# EasyEDA Pro project ProPrj_GoWinSDR_2025-10-27.epro, board PCB1_1
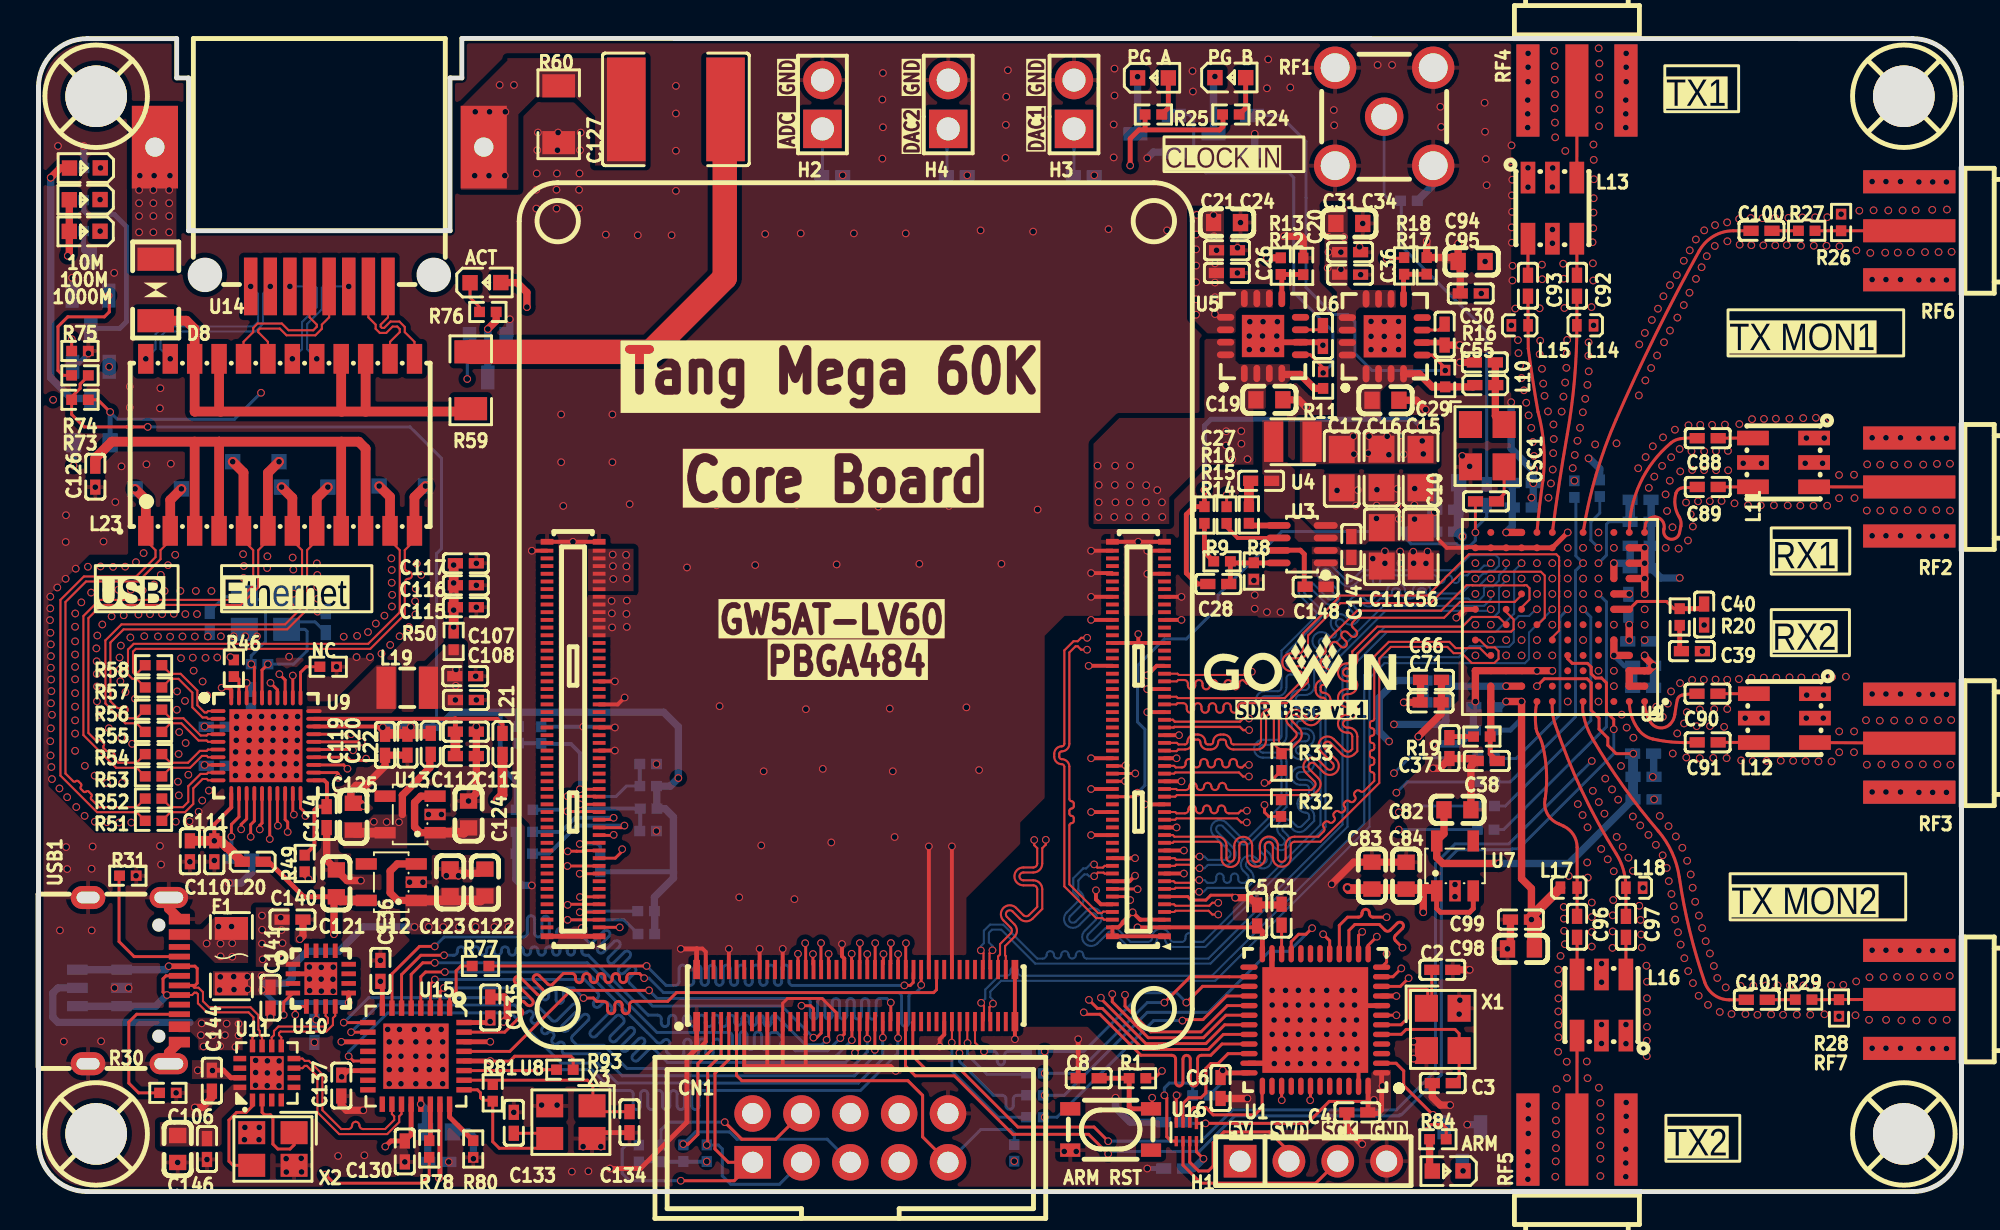
[diagram p8: board, top side]
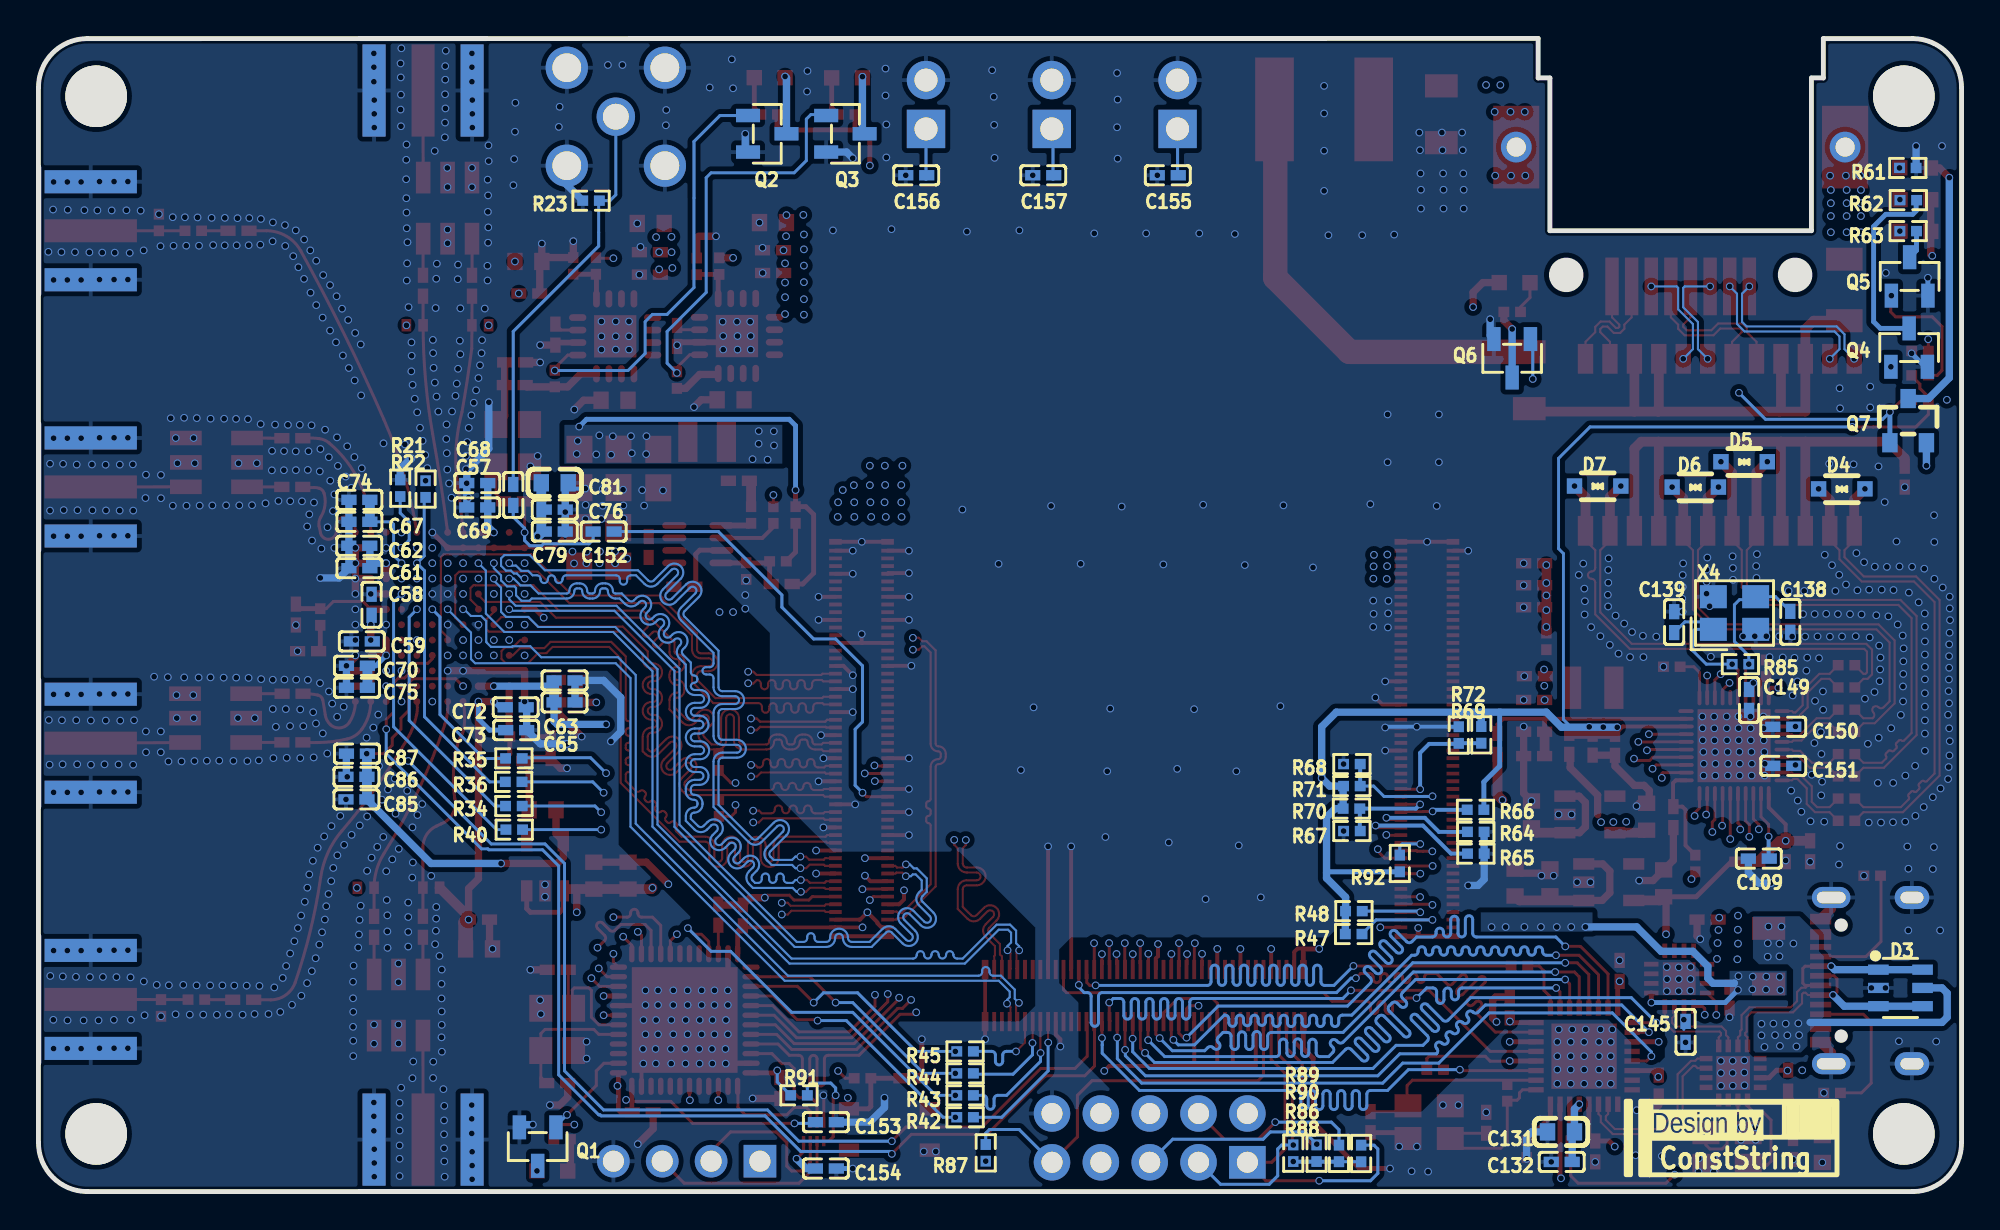
[diagram p9: board, bottom side, seen from below]

Outline 100 x 60.01 mm; copper layers: Top Layer, Inner1, Inner2, Inner3, Inner4, Bottom Layer. Coordinates in mm from the lower left corner of the outline.
Outline path: 7.81,57.95 7.19,57.95 7.19,60 2.54,60 arc(0.74,59.26) 0,57.46 0,2.54 arc(0.74,0.74) 2.54,0 97.46,0 arc(99.26,0.74) 100,2.54 100,57.46 arc(99.26,59.26) 97.46,60 22.02,60.01 22.02,57.95 21.41,57.95
Stack: Top Layer 0.035mm 外层铜厚1oz / Dielectric1 0.0994mm 3313 RC57% 4.2mil / Inner1 0.0152mm 内层铜厚 / Dielectric2 0.55mm 0.55mm H/H No copper / Inner2 0.0152mm 内层铜厚 / Dielectric3 0.1088mm 2116 RC54% 4.9mil / Inner3 0.0152mm 内层铜厚 / Dielectric4 0.55mm 0.55mm H/H No copper / Inner4 0.0152mm 内层铜厚 / Dielectric5 0.0994mm 3313 RC57% 4.2mil / Bottom Layer 0.035mm 外层铜厚1oz

## Design rules (mm)
net DN: DP26
net DP: DP26
net $7N3729: DP24
net $7N3719: DP24
net $7N3757: DP23
net $7N3751: DP23
net $7N3767: DP22
net $7N3761: DP22
net $7N3784: DP21
net $7N3774: DP21
net ETH0_MDI0_P: DP31
net ETH0_MDI0_N: DP31
net ETH0_MDI1_P: DP30
net ETH0_MDI1_N: DP30
net ETH0_MDI2_P: DP29
net ETH0_MDI2_N: DP29
net ETH0_MDI3_P: DP28
net ETH0_MDI3_N: DP28
net BANK1_B18_IOT104B: DP1
net BANK1_C17_IOT106B: DP3
net BANK2_E22_IOT140A: DP32
net BANK2_D22_IOT140B: DP32
net BANK2_E21_IOT138A: DP33
net BANK2_D21_IOT138B: DP33
net PHY0_MDI3_N: DP17
net PHY0_MDI3_P: DP17
net PHY0_MDI2_N: DP18
net PHY0_MDI2_P: DP18
net PHY0_MDI1_N: DP19
net PHY0_MDI1_P: DP19
net PHY0_MDI0_N: DP20
net PHY0_MDI0_P: DP20
net BANK1_C14_IOT85A: DP8
net BANK1_E13_IOT78A: DP4
net BANK2_A21_IOT135B: DP16
net BANK2_B22_IOT133B: DP15
net BANK2_E18_IOT117B: DP14
net BANK1_C13_IOT93A: DP7
net BANK1_C15_IOT85B: DP8
net BANK1_E14_IOT78B: DP4
net BANK2_B21_IOT135A: DP16
net BANK2_C22_IOT133A: DP15
net BANK2_F18_IOT117A: DP14
net BANK2_G22_IOT144B: DP13
net BANK1_A13_IOT95A: DP6
net BANK1_B13_IOT93B: DP7
net BANK1_D17_IOT106A: DP3
net BANK2_G21_IOT144A: DP13
net BANK2_C20_IOT131B: DP12
net BANK1_B15_IOT97A: DP5
net BANK1_A14_IOT95B: DP6
net BANK1_B17_IOT104A: DP1
net BANK2_D20_IOT131A: DP12
net BANK2_A19_IOT113B: DP10
net BANK1_A15_IOT99A: DP2
net BANK1_B16_IOT97B: DP5
net BANK2_C18_IOT115A: DP11
net BANK2_C19_IOT115B: DP11
net BANK2_A18_IOT113A: DP10
net BANK2_A20_IOT122B: DP9
net BANK1_A16_IOT99B: DP2
net BANK2_B20_IOT122A: DP9
net USART_DP: DP27
net USART_DN: DP27
net USB_DN: DP25
net USB_DP: DP25
template: 自定义配置
spacing copperThickness1oz (default): track to track 0.152, other pairs 0.102 to 0.3
spacing copperThickness2oz: track to track 0.203, other pairs 0.152 to 0.3
track width copperThickness1oz (default): min 0.127, default 0.157, max 2.54
track width copperThickness2oz: min 0.203, default 0.254, max 2.54
differential pair differentialPair (default): width min 0.102, default 0.109, max 2.54; gap min 0.152, default 0.152
via viaSize (default): diameter min 0.3, default 0.399, max 10; hole min 0.3, default 0.3, max 6.299

## Placement (name value [footprint] x y rotation side)
10M  XL-1608SURC-06  [LED0603-RD_RED]  2.41 53.27 180 top
100M  XL-1608SURC-06  [LED0603-RD_RED]  2.4 51.62 180 top
1000M  XL-1608SURC-06  [LED0603-RD_RED]  2.4 49.97 180 top
ACT  XL-1608SURC-06  [LED0603-RD_RED]  23.24 47.3 0 top
ARM  XL-1608SURC-06  [LED0603-RD_RED]  73.28 1.07 180 top
ARM RST  SKRPACE010  [KEY-SMD_4P-L4.2-W3.2-P2.20-LS4.6]  55.75 3.23 0 top
C1  100nF  [C0402]  64.64 14.41 270 top
C2  12pF  [C0402]  73 11.54 0 top
C3  12pF  [C0402]  73.03 5.64 0 top
C4  100nF  [C0402]  68.58 4.12 0 top
C5  100nF  [C0402]  63.37 14.37 270 top
C6  100nF  [C0402]  61.47 5.39 90 top
C8  100nF  [C0402]  54.61 5.9 0 top
C10  22uF  [C0805]  71.88 33.55 270 top
C11  22uF  [C0805]  69.85 33.55 270 top
C15  22uF  [C0805]  71.87 37.63 90 top
C16  22uF  [C0805]  69.84 37.63 90 top
C17  22uF  [C0805]  67.77 37.62 90 top
C19  4.7uF  [C0603]  64.01 41.2 180 top
C20  10nF  [C0402]  66.79 44.52 90 top
C21  10uF  [C0603]  61.81 50.43 180 top
C24  100nF  [C0402]  61.8 48.98 180 top
C26  100nF  [C0402]  61.8 47.8 180 top
C27  100nF  [C0402]  63.58 36.99 0 top
C28  220pF  [C0402]  61.35 31.62 180 top
C29  4.7uF  [C0603]  70.04 41.18 180 top
C30  10nF  [C0402]  73.12 44.6 90 top
C31  10uF  [C0603]  68.16 50.38 180 top
C34  100nF  [C0402]  68.21 48.89 180 top
C36  100nF  [C0402]  68.21 47.72 180 top
C37  1uF  [C0402]  73.37 23.08 90 top
C38  1nF  [C0402]  75.31 22.41 180 top
C39  1uF  [C0402]  85.98 28.12 180 top
C40  1nF  [C0402]  86.61 30.03 270 top
C55  100nF  [C0402]  75.21 43.15 180 top
C56  100nF  [C0402]  75.27 35.92 0 top
C57  100nF  [C0402]  75.31 36.25 270 bottom
C58  1uF  [C0402]  82.68 30.54 270 bottom
C59  10nF  [C0402]  83.19 28.63 180 bottom
C61  1uF  [C0402]  83.31 32.44 180 bottom
C62  1uF  [C0402]  83.32 33.61 180 bottom
C63  10nF  [C0402]  72.64 26.6 0 bottom
C65  10nF  [C0402]  72.64 25.46 0 bottom
C66  1uF  [C0402]  72.41 26.63 180 top
C67  1uF  [C0402]  83.31 34.85 180 bottom
C68  1uF  [C0402]  77.18 36.87 180 bottom
C69  1uF  [C0402]  77.18 35.6 180 bottom
C70  1uF  [C0402]  83.44 27.36 180 bottom
C71  10nF  [C0402]  72.39 25.46 180 top
C72  10nF  [C0402]  75.18 25.2 0 bottom
C73  10nF  [C0402]  75.16 24.01 0 bottom
C74  10nF  [C0402]  83.31 36 180 bottom
C75  10nF  [C0402]  83.44 26.22 180 bottom
C76  10nF  [C0402]  73.15 35.49 0 bottom
C79  1uF  [C0402]  73.15 34.35 0 bottom
C81  10uF  [C0603]  73.15 36.89 0 bottom
C82  10uF  [C0603]  73.79 19.87 0 top
C83  10uF  [C0603]  71.12 16.44 90 top
C84  100nF  [C0603]  69.34 16.44 270 top
C85  10nF  [C0402]  83.47 20.41 180 bottom
C86  1uF  [C0402]  83.46 21.58 180 bottom
C87  100nF  [C0402]  83.44 22.79 180 bottom
C88  18pF  [C0402]  86.8 39.2 180 top
C89  18pF  [C0402]  86.8 36.67 180 top
C90  18pF  [C0402]  86.79 25.91 180 top
C91  18pF  [C0402]  86.8 23.38 180 top
C92  18pF  [C0402]  80 47.14 90 top
C93  18pF  [C0402]  77.45 47.14 90 top
C94  10uF  [C0603]  74.52 48.4 0 top
C95  1nF  [C0402]  74.48 46.74 0 top
C96  18pF  [C0402]  80.01 13.78 270 top
C97  18pF  [C0402]  82.55 13.78 270 top
C98  10uF  [C0603]  77.09 12.63 0 top
C99  1nF  [C0402]  77.09 14.15 0 top
C100  1nF  [C0402]  89.6 50 180 top
C101  1nF  [C0402]  89.35 9.98 180 top
C106  10uF  [C0603]  7.24 2.22 270 top
C107  4.7uF  [C0402]  22.19 26.82 0 top
C108  100nF  [C0402]  22.22 25.58 0 top
C109  10nF  [C0402]  10.54 17.33 0 bottom
C110  100nF  [C0402]  9.14 17.71 90 top
C111  100nF  [C0402]  7.87 17.71 90 top
C112  4.7uF  [C0402]  22.22 23.93 180 top
C113  100nF  [C0402]  22.22 22.66 180 top
C114  100nF  [C0402]  14.99 19.49 90 top
C115  100nF  [C0402]  22.22 30.41 180 top
C116  100nF  [C0402]  22.22 31.55 180 top
C117  100nF  [C0402]  22.22 32.69 180 top
C119  4.7uF  [C0402]  18.02 23.25 90 top
C120  100nF  [C0402]  19.19 23.26 90 top
C121  10uF  [C0603]  15.49 16.04 90 top
C122  10uF  [C0603]  23.22 16.08 90 top
C123  100nF  [C0603]  21.41 16.09 270 top
C124  1uF  [C0603]  22.36 19.62 270 top
C125  1uF  [C0603]  16.38 19.51 270 top
C126  10nF  [C0402]  2.96 37.2 90 top
C127  1nF  [C2220]  33.15 56.32 0 top
C130  2.2uF  [C0402]  19.05 2.09 270 top
C131  100nF  [C0402]  20.79 1.54 180 bottom
C132  10uF  [C0603]  20.83 3.1 180 bottom
C133  12pF  [C0402]  24.72 3.58 90 top
C134  12pF  [C0402]  30.73 3.61 270 top
C135  100nF  [C0402]  23.5 9.58 270 top
C136  100nF  [C0402]  17.78 11.49 270 top
C137  100nF  [C0402]  15.75 5.52 90 top
C138  12pF  [C0402]  8.91 29.65 90 bottom
C139  12pF  [C0402]  14.94 29.64 90 bottom
C140  1uF  [C0402]  13.21 14.15 0 top
C141  1uF  [C0402]  12.06 10.09 270 top
C144  1uF  [C0402]  9.02 5.77 270 top
C145  100nF  [C0402]  14.35 8.31 90 bottom
C146  100nF  [C0402]  8.76 2.22 270 top
C147  1uF  [C0402]  68.27 33.54 270 top
C148  1uF  [C0402]  66.41 31.48 180 top
C149  100nF  [C0402]  11.05 25.58 90 bottom
C150  100nF  [C0402]  9.27 24.19 180 bottom
C151  100nF  [C0402]  9.27 22.15 180 bottom
C152  100nF  [C0402]  70.61 34.35 0 bottom
C153  100nF  [C0402]  59.06 3.61 0 bottom
C154  100nF  [C0402]  59.06 1.2 180 bottom
C155  100nF  [C0402]  41.28 52.89 0 bottom
C156  100nF  [C0402]  54.36 52.89 0 bottom
C157  100nF  [C0402]  47.75 52.89 0 bottom
CN1  DC3-2.54-10PAS  [CONN-TH_10P-P2.54_DC3-2.54-10PAS]  42.22 2.79 0 top
D3  BST236A054U-ES  [SOT-23-6_L2.9-W1.6-P0.95-LS2.8-TL]  3.17 10.6 180 bottom
D4  UDD32C03L01  [SOD-323_L1.7-W1.3-LS2.5-BI]  6.23 36.57 0 bottom
D5  UDD32C03L01  [SOD-323_L1.7-W1.3-LS2.5-BI]  11.31 37.98 0 bottom
D6  UDD32C03L01  [SOD-323_L1.7-W1.3-LS2.5-BI]  13.85 36.66 0 bottom
D7  UDD32C03L01  [SOD-323_L1.7-W1.3-LS2.5-BI]  18.92 36.72 0 bottom
D8  SMB90XM  [DIO-DT-SMD_L3.2-W1.6]  6.1 46.92 90 top
F1  SMD1206-100-30  [F1206]  10.03 12.25 270 top
H1  PZ254V-11-04P  [HDR-TH_4P-P2.54-V-M]  66.29 1.58 0 top
H2  PZ254V-11-02P  [HDR-TH_2P-P2.54-V-M]  40.77 56.57 90 top
H3  PZ254V-11-02P  [HDR-TH_2P-P2.54-V-M]  53.85 56.57 90 top
H4  PZ254V-11-02P  [HDR-TH_2P-P2.54-V-M]  47.31 56.57 90 top
L10  BLM15PD121SN1D  [L0402]  75.23 41.97 180 top
L11  TCM1-63AX+  [XFMR-SMD_TCM1-63AX]  90.74 37.94 270 top
L12  TCM1-63AX+  [XFMR-SMD_TCM1-63AX]  90.79 24.64 270 top
L13  TCM1-63AX+  [XFMR-SMD_TCM1-63AX]  78.73 51.18 0 top
L14  330nH  [IND-SMD_L1.0-W0.6]  80.43 45.08 180 top
L15  330nH  [IND-SMD_L1.0-W0.6]  77.03 45.08 0 top
L16  TCM1-63AX+  [XFMR-SMD_TCM1-63AX]  81.28 9.71 180 top
L17  330nH  [IND-SMD_L1.0-W0.6]  79.58 15.82 0 top
L18  330nH  [IND-SMD_L1.0-W0.6]  82.98 15.81 180 top
L19  2.2uH  [IND-SMD_L2.5-W2.0_MHCHL2520]  19.18 26.22 0 top
L20  BLM15PD121SN1D  [L0402]  11.14 17.16 180 top
L21  BLM15PD121SN1D  [L0402]  24.13 23.3 90 top
L22  BLM15PD121SN1D  [L0402]  20.4 23.3 90 top
L23  350uH  [XFMR-SMD_24P-L15.6-W8.5-P1.27-LS9.5-BL]  12.57 38.86 0 top
NC  5.1kΩ  [R0402]  15.07 27.31 0 top
OSC1  40MHz  [OSC-SMD_4P-L3.2-W2.5-BL]  75.34 38.81 270 top
PG A  NCD0603Y2  [LED0603-RD]  57.95 57.95 0 top
PG B  NCD0603Y2  [LED0603-RD]  61.98 57.97 0 top
Q1  AO3400A  [SOT-23-3_L2.9-W1.3-P1.90-LS2.4-BR]  74.04 2.34 90 bottom
Q2  AO3400A  [SOT-23-3_L2.9-W1.3-P1.90-LS2.4-BR]  62.1 55.05 0 bottom
Q3  AO3400A  [SOT-23-3_L2.9-W1.3-P1.90-LS2.4-BR]  58.04 55.05 0 bottom
Q4  AO3400A  [SOT-23-3_L2.9-W1.3-P1.90-LS2.4-BR]  2.72 43.92 270 bottom
Q5  AO3400A  [SOT-23-3_L2.9-W1.3-P1.90-LS2.4-BR]  2.7 47.62 270 bottom
Q6  AO3400A  [SOT-23-3_L2.9-W1.3-P1.90-LS2.4-BR]  23.37 43.36 90 bottom
Q7  AO3401A  [SOT-23_L2.9-W1.3-P1.90-LS2.4-BR]  2.78 40.12 270 bottom
R1  10kΩ  [R0402]  57.15 5.9 180 top
R8  43kΩ  [R0402]  63.2 32.29 90 top
R9  86.6kΩ  [R0402]  61.55 32.8 180 top
R10  0Ω  [R0402]  60.63 35.21 90 top
R11  10kΩ  [R0402]  66.8 42.23 270 top
R12  16kΩ  [R0402]  64.6 48.16 90 top
R13  10kΩ  [R0402]  65.77 48.15 270 top
R14  10Ω  [R0402]  62.94 35.21 270 top
R15  10kΩ  [R0402]  61.78 35.21 270 top
R16  10kΩ  [R0402]  73.15 42.31 270 top
R17  16kΩ  [R0402]  71.01 48.17 90 top
R18  10kΩ  [R0402]  72.19 48.17 270 top
R19  1Ω  [R0402]  75.06 23.68 0 top
R20  1Ω  [R0402]  85.34 29.9 90 top
R21  10kΩ  [R0402]  79.87 36.56 90 bottom
R22  14.3kΩ  [R0402]  81.19 36.6 90 bottom
R23  49.9Ω  [R0402]  71.27 51.56 180 bottom
R24  10kΩ  [R0402]  62.01 56.05 180 top
R25  10kΩ  [R0402]  57.98 56.05 180 top
R26  49.9Ω  [R0402]  93.74 50.43 270 top
R27  10Ω  [R0402]  91.95 50 180 top
R28  49.9Ω  [R0402]  93.63 9.55 90 top
R29  10Ω  [R0402]  91.79 9.99 180 top
R30  5.1kΩ  [R0402]  6.73 5.14 0 top
R31  5.1kΩ  [R0402]  4.65 16.44 0 top
R32  NC  [R0402]  64.61 19.96 270 top
R33  NC  [R0402]  64.64 22.35 270 top
R34  0Ω  [R0402]  75.28 20.06 0 bottom
R35  0Ω  [R0402]  75.28 22.54 0 bottom
R36  0Ω  [R0402]  75.29 21.32 0 bottom
R40  0Ω  [R0402]  75.26 18.83 0 bottom
R42  0Ω  [R0402]  51.82 3.87 0 bottom
R43  0Ω  [R0402]  51.82 5.01 0 bottom
R44  0Ω  [R0402]  51.82 6.15 0 bottom
R45  0Ω  [R0402]  51.82 7.29 0 bottom
R46  2.49kΩ  [R0402]  10.16 27.23 90 top
R47  1.5kΩ  [R0402]  31.61 13.4 0 bottom
R48  1.5kΩ  [R0402]  31.6 14.59 0 bottom
R49  0Ω  [R0402]  13.84 17.07 90 top
R50  0Ω  [R0402]  21.59 28.63 90 top
R51  2.2Ω  [R0402]  5.98 19.3 180 top
R52  2.2Ω  [R0402]  5.98 20.45 180 top
R53  2.2Ω  [R0402]  5.98 21.61 180 top
R54  2.2Ω  [R0402]  5.98 22.76 180 top
R55  2.2Ω  [R0402]  5.98 23.92 180 top
R56  2.2Ω  [R0402]  5.98 25.08 180 top
R57  2.2Ω  [R0402]  5.98 26.23 180 top
R58  2.2Ω  [R0402]  5.98 27.39 180 top
R59  75Ω  [R1206]  22.48 42.22 270 top
R60  0Ω  [R1206]  27.05 56.06 90 top
R61  10kΩ  [R0402]  2.79 53.27 180 bottom
R62  10kΩ  [R0402]  2.77 51.59 180 bottom
R63  10kΩ  [R0402]  2.77 49.98 180 bottom
R64  5.1kΩ  [R0402]  25.26 18.72 180 bottom
R65  5.1kΩ  [R0402]  25.26 17.59 180 bottom
R66  5.1kΩ  [R0402]  25.27 19.87 0 bottom
R67  5.1kΩ  [R0402]  31.7 18.76 0 bottom
R68  5.1kΩ  [R0402]  31.7 22.25 0 bottom
R69  5.1kΩ  [R0402]  26.14 23.76 90 bottom
R70  5.1kΩ  [R0402]  31.72 19.93 180 bottom
R71  5.1kΩ  [R0402]  31.7 21.1 180 bottom
R72  5.1kΩ  [R0402]  24.97 23.77 270 bottom
R73  5.1kΩ  [R0402]  2.16 41.2 0 top
R74  5.1kΩ  [R0402]  2.16 42.47 180 top
R75  5.1kΩ  [R0402]  2.16 43.74 0 top
R76  10kΩ  [R0402]  23.37 45.78 0 top
R77  33Ω  [R0402]  22.99 11.74 180 top
R78  1kΩ  [R0402]  20.32 2.22 270 top
R80  8.06kΩ  [R0402]  22.61 2.22 270 top
R81  10MΩ  [R0402]  23.62 5.14 270 top
R84  10kΩ  [R0402]  72.77 2.72 0 top
R85  10MΩ  [R0402]  11.5 27.45 180 bottom
R86  10kΩ  [R0402]  32.37 1.99 270 bottom
R87  10kΩ  [R0402]  50.74 2.02 270 bottom
R88  10kΩ  [R0402]  31.22 1.98 270 bottom
R89  10kΩ  [R0402]  34.75 2 270 bottom
R90  10kΩ  [R0402]  33.54 2 270 bottom
R91  10kΩ  [R0402]  60.45 5.01 180 bottom
R92  5.1kΩ  [R0402]  29.21 17.07 90 bottom
R93  5.1kΩ  [R0402]  27.37 6.34 180 top
RF1  -  [SMA-TH_BWSMA-KE-Z001]  69.98 55.94 0 top
RF2  -  [SMA-SMD_BWSMA-KE-P001]  97.28 36.67 0 top
RF3  -  [SMA-SMD_BWSMA-KE-P001]  97.28 23.33 0 top
RF4  -  [SMA-SMD_BWSMA-KE-P001]  80 57.3 90 top
RF5  -  [SMA-SMD_BWSMA-KE-P001]  80 2.71 270 top
RF6  -  [SMA-SMD_BWSMA-KE-P001]  97.28 50 0 top
RF7  -  [SMA-SMD_BWSMA-KE-P001]  97.28 10 0 top
SCREW1  -  [M3螺丝]  3 57 0 top
SCREW2  -  [M3螺丝]  97 57 0 top
SCREW3  -  [M3螺丝]  97 3 0 top
SCREW4  -  [M3螺丝]  3 3 0 top
U1  STM32F411CEU6  [UFQFPN-48_L7.0-W7.0-P0.50-BL-EP]  66.39 8.93 90 top
U2  AD9363ABCZ  [CSPBGA-144_L10.0-W10.0-R12-C12-P0.80-TL]  79.12 29.9 180 top
U3  MP2236GJ-Z  [SOT-23-8_L2.9-W1.6-P0.65-LS2.8-BR]  65.71 33.69 0 top
U4  1.5uH  [IND-SMD_L2.5-W2.0_MEKK2520TR47M]  65.23 39.02 180 top
U5  ADP1755ACPZ-R7  [LFCSP-16_L4.0-W4.0-P0.65-BL-EP2.2]  63.68 44.52 0 top
U6  ADP1755ACPZ-R7  [LFCSP-16_L4.0-W4.0-P0.65-BL-EP2.2]  70.01 44.51 0 top
U7  ME6217C33M5G  [SOT-23-5_L3.0-W1.7-P0.95-LS2.8-BR]  73.66 16.95 270 top
U8  -  [Tang Mega 60K]  25 7.5 90 top
U9  RTL8211F-CG  [WQFN-40_L5.0-W5.0-P0.4-BL-EP]  11.83 23.2 270 top
U10  CH343P  [TQFN-16_L3.0-W3.0-P0.50-BL-EP1.7]  14.68 11.08 270 top
U11  CH334P  [QFN-16_L3.0-W3.0-P0.50-BL-EP1.7]  11.88 6.17 0 top
U12  ME6217C33M5G  [SOT-23-5_L3.0-W1.7-P0.95-LS2.8-BR]  18.34 16.1 0 top
U13  ME6211C18M5G-N  [SOT-23-5_L3.0-W1.7-P0.95-LS2.8-BR]  19.33 19.63 0 top
U14  HC-WK88-H865T-QB  [RJ45-TH_HC-WK88-H865T-BB]  14.61 50.73 180 top
U15  USB3320C-EZK  [QFN-32_L5.0-W5.0-P0.50-BL-EP3.4]  19.63 7.05 180 top
U16  TXS0102DQER  [X2SON-8_L1.4-W1.0-P0.35-BL]  59.69 3.1 180 top
USB1  TYPE-C 16PIN 2MD(073)  [USB-C-SMD_TYPE-C-6PIN-2MD-073]  4.95 10.98 270 top
X1  25MHz  [CRYSTAL-SMD_4P-L3.2-W2.5-BL]  73.03 8.44 270 top
X2  12MHz  [CRYSTAL-SMD_4P-L3.2-W2.5-BL]  12.19 2.22 180 top
X3  24MHz  [CRYSTAL-SMD_4P-L3.2-W2.5-BL]  27.69 3.61 180 top
X4  25MHz  [CRYSTAL-SMD_4P-L3.2-W2.5-BL]  11.81 30.11 180 bottom

## Footprints (pads in the part's own frame, mm; a bottom-side part is the same pattern mirrored in y, then rotated)
C0402
  rect 0.79x0.54 smd: 1(-0.545,0) 2(0.545,0)
C0603
  rect 0.8x0.9 smd: 1(-0.7,0) 2(0.7,0)
C0805
  rect 1.41x1.35 smd: 1(-1,0) 2(1,0)
C2220
  rect 2.01x5.4 smd: 1(-2.58,0) 2(2.58,0)
CONN-TH_10P-P2.54_DC3-2.54-10PAS
  rect 1.9x1.7 hole 1.1: 1(-5.08,-1.27)
  round 1.9 hole 1.1: 2(-5.08,1.27) 3(-2.54,-1.27) 4(-2.54,1.27) 5(0,-1.27) 6(0,1.27) 7(2.54,-1.27) 8(2.54,1.27) 9(5.08,-1.27) 10(5.08,1.27)
CRYSTAL-SMD_4P-L3.2-W2.5-BL
  rect 1.4x1.2 smd: 1(-1.1,-0.85) 2(1.1,-0.85) 3(1.1,0.85) 4(-1.1,0.85)
CSPBGA-144_L10.0-W10.0-R12-C12-P0.80-TL
  round 0.36 smd: A1(-4.4,4.4) A2(-3.6,4.4) A3(-2.8,4.4) A4(-2,4.4) A5(-1.2,4.4) A6(-0.4,4.4) A7(0.4,4.4) A8(1.2,4.4) A9(2,4.4) A10(2.8,4.4) A11(3.6,4.4) A12(4.4,4.4) B1(-4.4,3.6) B2(-3.6,3.6) B3(-2.8,3.6) B4(-2,3.6) B5(-1.2,3.6) B6(-0.4,3.6) B7(0.4,3.6) B8(1.2,3.6) B9(2,3.6) B10(2.8,3.6) B11(3.6,3.6) B12(4.4,3.6) C1(-4.4,2.8) C2(-3.6,2.8) C3(-2.8,2.8) C4(-2,2.8) C5(-1.2,2.8) C6(-0.4,2.8) C7(0.4,2.8) C8(1.2,2.8) C9(2,2.8) C10(2.8,2.8) C11(3.6,2.8) C12(4.4,2.8) D1(-4.4,2) D2(-3.6,2) D3(-2.8,2) D4(-2,2) D5(-1.2,2) D6(-0.4,2) D7(0.4,2) D8(1.2,2) D9(2,2) D10(2.8,2) D11(3.6,2) D12(4.4,2) E1(-4.4,1.2) E2(-3.6,1.2) E3(-2.8,1.2) E4(-2,1.2) E5(-1.2,1.2) E6(-0.4,1.2) E7(0.4,1.2) E8(1.2,1.2) E9(2,1.2) E10(2.8,1.2) E11(3.6,1.2) E12(4.4,1.2) F1(-4.4,0.4) F2(-3.6,0.4) F3(-2.8,0.4) F4(-2,0.4) F5(-1.2,0.4) F6(-0.4,0.4) F7(0.4,0.4) F8(1.2,0.4) F9(2,0.4) F10(2.8,0.4) F11(3.6,0.4) F12(4.4,0.4) G1(-4.4,-0.4) G2(-3.6,-0.4) G3(-2.8,-0.4) G4(-2,-0.4) G5(-1.2,-0.4) G6(-0.4,-0.4) G7(0.4,-0.4) G8(1.2,-0.4) G9(2,-0.4) G10(2.8,-0.4) G11(3.6,-0.4) G12(4.4,-0.4) H1(-4.4,-1.2) H2(-3.6,-1.2) H3(-2.8,-1.2) H4(-2,-1.2) H5(-1.2,-1.2) H6(-0.4,-1.2) H7(0.4,-1.2) H8(1.2,-1.2) H9(2,-1.2) H10(2.8,-1.2) H11(3.6,-1.2) H12(4.4,-1.2) J1(-4.4,-2) J2(-3.6,-2) J3(-2.8,-2) J4(-2,-2) J5(-1.2,-2) J6(-0.4,-2) J7(0.4,-2) J8(1.2,-2) J9(2,-2) J10(2.8,-2) J11(3.6,-2) J12(4.4,-2) K1(-4.4,-2.8) K2(-3.6,-2.8) K3(-2.8,-2.8) K4(-2,-2.8) K5(-1.2,-2.8) K6(-0.4,-2.8) K7(0.4,-2.8) K8(1.2,-2.8) K9(2,-2.8) K10(2.8,-2.8) K11(3.6,-2.8) K12(4.4,-2.8) L1(-4.4,-3.6) L2(-3.6,-3.6) L3(-2.8,-3.6) L4(-2,-3.6) L5(-1.2,-3.6) L6(-0.4,-3.6) L7(0.4,-3.6) L8(1.2,-3.6) L9(2,-3.6) L10(2.8,-3.6) L11(3.6,-3.6) L12(4.4,-3.6) M1(-4.4,-4.4) M2(-3.6,-4.4) M3(-2.8,-4.4) M4(-2,-4.4) M5(-1.2,-4.4) M6(-0.4,-4.4) M7(0.4,-4.4) M8(1.2,-4.4) M9(2,-4.4) M10(2.8,-4.4) M11(3.6,-4.4) M12(4.4,-4.4)
DIO-DT-SMD_L3.2-W1.6
  rect 1.2x1.9 smd: 1(-1.6,0) 2(1.6,0)
F1206
  rect 1.19x1.728 smd: 1(-1.445,0) 2(1.445,0)
HDR-TH_2P-P2.54-V-M
  rect 2x2 hole 1.2: 1(-1.27,0)
  round 2 hole 1.2: 2(1.27,0)
HDR-TH_4P-P2.54-V-M
  rect 1.7x1.7 hole 1.1: 1(-3.81,0)
  round 1.7 hole 1.1: 2(-1.27,0) 3(1.27,0) 4(3.81,0)
IND-SMD_L1.0-W0.6
  rect 0.5x0.648 smd: 1(-0.434,0) 2(0.434,0)
IND-SMD_L2.5-W2.0_MEKK2520TR47M
  rect 1x2.1 smd: 1(1,0) 2(-1,0)
IND-SMD_L2.5-W2.0_MHCHL2520
  rect 1x2.2 smd: 1(-1.1,0) 2(1.1,0)
KEY-SMD_4P-L4.2-W3.2-P2.20-LS4.6
  rect 1.05x0.7 smd: 1(-2.1,1.075) 2(2.1,1.075) 3(-2.1,-1.075) 4(2.1,-1.075)
L0402
  rect 0.79x0.54 smd: 1(-0.545,0) 2(0.545,0)
LED0603-RD
  rect 0.8x0.8 smd: 1(-0.799,0) 2(0.799,0)
LED0603-RD_RED
  rect 0.8x0.8 smd: 1(-0.799,-0.004) 2(0.799,0.004)
LFCSP-16_L4.0-W4.0-P0.65-BL-EP2.2
  oval 0.35x0.9 smd: 1(-0.975,-1.95) 2(-0.325,-1.95) 3(0.325,-1.95) 4(0.975,-1.95) 9(0.975,1.95) 10(0.325,1.95) 11(-0.325,1.95) 12(-0.975,1.95)
  oval 0.9x0.35 smd: 5(1.95,-0.975) 6(1.95,-0.325) 7(1.95,0.325) 8(1.95,0.975) 13(-1.95,0.975) 14(-1.95,0.325) 15(-1.95,-0.325) 16(-1.95,-0.975)
  rect 2.2x2.2 smd: 17(0,0)
M3螺丝
  round 3.2 hole 3.2: 1(0,0)
OSC-SMD_4P-L3.2-W2.5-BL
  rect 1.4x1.2 smd: 1(-1.1,-0.875) 2(1.1,-0.875) 3(1.1,0.875) 4(-1.1,0.875)
QFN-16_L3.0-W3.0-P0.50-BL-EP1.7
  rect 0.28x0.665 smd: 1(-0.75,-1.407) 2(-0.25,-1.407) 3(0.25,-1.407) 4(0.75,-1.407) 9(0.75,1.407) 10(0.25,1.407) 11(-0.25,1.407) 12(-0.75,1.407)
  rect 0.665x0.28 smd: 5(1.407,-0.75) 6(1.407,-0.25) 7(1.407,0.25) 8(1.407,0.75) 13(-1.407,0.75) 14(-1.407,0.25) 15(-1.407,-0.25) 16(-1.407,-0.75)
  rect 1.75x1.75 smd: 17(0,0)
QFN-32_L5.0-W5.0-P0.50-BL-EP3.4
  rect 0.28x0.8 smd: 1(-1.75,-2.5) 2(-1.252,-2.5) 3(-0.751,-2.5) 4(-0.252,-2.5) 5(0.248,-2.5) 6(0.749,-2.5) 7(1.248,-2.5) 8(1.748,-2.5) 17(1.752,2.5) 18(1.252,2.5) 19(0.751,2.5) 20(0.252,2.5) 21(-0.248,2.5) 22(-0.749,2.5) 23(-1.248,2.5) 24(-1.748,2.5)
  rect 0.8x0.28 smd: 9(2.5,-1.748) 10(2.5,-1.248) 11(2.5,-0.748) 12(2.5,-0.248) 13(2.5,0.252) 14(2.5,0.752) 15(2.5,1.252) 16(2.5,1.752) 25(-2.5,1.75) 26(-2.5,1.25) 27(-2.5,0.75) 28(-2.5,0.25) 29(-2.5,-0.25) 30(-2.5,-0.75) 31(-2.5,-1.25) 32(-2.5,-1.75)
  rect 3.4x3.4 smd: 33(0,0)
R0402
  rect 0.566x0.54 smd: 1(-0.433,0) 2(0.433,0)
R1206
  rect 1.208x1.701 smd: 1(-1.479,0) 2(1.479,0)
RJ45-TH_HC-WK88-H865T-BB
  rect 0.7x3 smd: 1(-3.57,3.625) 2(-2.55,3.625) 3(-1.53,3.625) 4(-0.51,3.625) 5(0.51,3.625) 6(1.53,3.625) 7(2.55,3.625) 8(3.57,3.625)
  round 1.6 hole 1: 9(-8.55,-3.625) 10(8.55,-3.625)
  rect 2.4x4.3 smd: 9(-8.55,-3.625) 10(8.55,-3.625)
SMA-SMD_BWSMA-KE-P001
  rect 4.8x1.2 smd: 1(0,-2.55) 2(0,2.55) 5(0,0)
  rect 4.8x1.2 smd far side: 3(0,2.55) 4(0,-2.55)
SMA-TH_BWSMA-KE-Z001
  round 2.2 hole 1.5: 1(-2.55,-2.55) 2(-2.55,2.55) 3(2.55,2.55) 4(2.55,-2.55)
  round 2 hole 1.35: 5(0,0)
SOD-323_L1.7-W1.3-LS2.5-BI
  rect 0.8x0.8 smd: 1(-1.205,0) 2(1.205,0)
SOT-23-3_L2.9-W1.3-P1.90-LS2.4-BR
  rect 1.25x0.7 smd: 1(1,-0.95) 2(1,0.95) 3(-1,0)
SOT-23-5_L3.0-W1.7-P0.95-LS2.8-BR
  rect 1.1x0.6 smd: 1(1.3,-0.95) 2(1.3,0) 3(1.3,0.95) 4(-1.3,0.95) 5(-1.3,-0.95)
SOT-23-6_L2.9-W1.6-P0.95-LS2.8-TL
  rect 1.072x0.532 smd: 1(-1.149,0.95) 2(-1.149,0) 3(-1.149,-0.95) 4(1.149,-0.95) 5(1.149,0) 6(1.149,0.95)
SOT-23-8_L2.9-W1.6-P0.65-LS2.8-BR
  oval 1.252x0.35 smd: 1(1.226,-0.975) 2(1.226,-0.325) 3(1.226,0.325) 4(1.226,0.975) 5(-1.226,0.975) 6(-1.226,0.325) 7(-1.226,-0.325) 8(-1.226,-0.975)
SOT-23_L2.9-W1.3-P1.90-LS2.4-BR
  rect 1x0.8 smd: 1(1.15,-0.95) 2(1.15,0.95) 3(-1.15,0)
Tang Mega 60K
  rect 0.2x0.66 smd: A1(6.25,-33.555) A2(6.25,-30.845) A3(6.65,-33.555) A4(6.65,-30.845) A5(7.05,-33.555) A6(7.05,-30.845) A7(7.45,-33.555) A8(7.45,-30.845) A9(7.85,-33.555) A10(7.85,-30.845) A11(8.25,-33.555) A12(8.25,-30.845) A13(8.65,-33.555) A14(8.65,-30.845) A15(9.05,-33.555) A16(9.05,-30.845) A17(9.45,-33.555) A18(9.45,-30.845) A19(9.85,-33.555) A20(9.85,-30.845) A21(10.25,-33.555) A22(10.25,-30.845) A23(10.65,-33.555) A24(10.65,-30.845) A25(11.05,-33.555) A26(11.05,-30.845) A27(11.45,-33.555) A28(11.45,-30.845) A29(11.85,-33.555) A30(11.85,-30.845) A31(12.25,-33.555) A32(12.25,-30.845) A33(12.65,-33.555) A34(12.65,-30.845) A35(13.05,-33.555) A36(13.05,-30.845) A37(13.45,-33.555) A38(13.45,-30.845) A39(13.85,-33.555) A40(13.85,-30.845) A41(14.25,-33.555) A42(14.25,-30.845) A43(14.65,-33.555) A44(14.65,-30.845) A45(15.05,-33.555) A46(15.05,-30.845) A47(15.45,-33.555) A48(15.45,-30.845) A49(15.85,-33.555) A50(15.85,-30.845) A51(16.25,-33.555) A52(16.25,-30.845) A53(16.65,-33.555) A54(16.65,-30.845) A55(17.05,-33.555) A56(17.05,-30.845) A57(17.45,-33.555) A58(17.45,-30.845) A59(17.85,-33.555) A60(17.85,-30.845) A61(18.25,-33.555) A62(18.25,-30.845) A63(18.65,-33.555) A64(18.65,-30.845) A65(19.05,-33.555) A66(19.05,-30.845) A67(19.45,-33.555) A68(19.45,-30.845) A69(19.85,-33.555) A70(19.85,-30.845) A71(20.25,-33.555) A72(20.25,-30.845) A73(20.65,-33.555) A74(20.65,-30.845) A75(21.05,-33.555) A76(21.05,-30.845) A77(21.45,-33.555) A78(21.45,-30.845) A79(21.85,-33.555) A80(21.85,-30.845) A81(22.25,-33.555) A82(22.25,-30.845) A83(22.65,-33.555) A84(22.65,-30.845) A85(23.05,-33.555) A86(23.05,-30.845) A87(23.45,-33.555) A88(23.45,-30.845) A89(23.85,-33.555) A90(23.85,-30.845) A91(24.25,-33.555) A92(24.25,-30.845) A93(24.65,-33.555) A94(24.65,-30.845) A95(25.05,-33.555) A96(25.05,-30.845) A97(25.45,-33.555) A98(25.45,-30.845) A99(25.85,-33.555) A100(25.85,-30.845) B1(6.25,-4.155) B2(6.25,-1.445) B3(6.65,-4.155) B4(6.65,-1.445) B5(7.05,-4.155) B6(7.05,-1.445) B7(7.45,-4.155) B8(7.45,-1.445) B9(7.85,-4.155) B10(7.85,-1.445) B11(8.25,-4.155) B12(8.25,-1.445) B13(8.65,-4.155) B14(8.65,-1.445) B15(9.05,-4.155) B16(9.05,-1.445) B17(9.45,-4.155) B18(9.45,-1.445) B19(9.85,-4.155) B20(9.85,-1.445) B21(10.25,-4.155) B22(10.25,-1.445) B23(10.65,-4.155) B24(10.65,-1.445) B25(11.05,-4.155) B26(11.05,-1.445) B27(11.45,-4.155) B28(11.45,-1.445) B29(11.85,-4.155) B30(11.85,-1.445) B31(12.25,-4.155) B32(12.25,-1.445) B33(12.65,-4.155) B34(12.65,-1.445) B35(13.05,-4.155) B36(13.05,-1.445) B37(13.45,-4.155) B38(13.45,-1.445) B39(13.85,-4.155) B40(13.85,-1.445) B41(14.25,-4.155) B42(14.25,-1.445) B43(14.65,-4.155) B44(14.65,-1.445) B45(15.05,-4.155) B46(15.05,-1.445) B47(15.45,-4.155) B48(15.45,-1.445) B49(15.85,-4.155) B50(15.85,-1.445) B51(16.25,-4.155) B52(16.25,-1.445) B53(16.65,-4.155) B54(16.65,-1.445) B55(17.05,-4.155) B56(17.05,-1.445) B57(17.45,-4.155) B58(17.45,-1.445) B59(17.85,-4.155) B60(17.85,-1.445) B61(18.25,-4.155) B62(18.25,-1.445) B63(18.65,-4.155) B64(18.65,-1.445) B65(19.05,-4.155) B66(19.05,-1.445) B67(19.45,-4.155) B68(19.45,-1.445) B69(19.85,-4.155) B70(19.85,-1.445) B71(20.25,-4.155) B72(20.25,-1.445) B73(20.65,-4.155) B74(20.65,-1.445) B75(21.05,-4.155) B76(21.05,-1.445) B77(21.45,-4.155) B78(21.45,-1.445) B79(21.85,-4.155) B80(21.85,-1.445) B81(22.25,-4.155) B82(22.25,-1.445) B83(22.65,-4.155) B84(22.65,-1.445) B85(23.05,-4.155) B86(23.05,-1.445) B87(23.45,-4.155) B88(23.45,-1.445) B89(23.85,-4.155) B90(23.85,-1.445) B91(24.25,-4.155) B92(24.25,-1.445) B93(24.65,-4.155) B94(24.65,-1.445) B95(25.05,-4.155) B96(25.05,-1.445) B97(25.45,-4.155) B98(25.45,-1.445) B99(25.85,-4.155) B100(25.85,-1.445)
  rect 0.3x0.66 smd: AS1(5.785,-33.555) AS2(5.785,-30.845) AS3(26.315,-33.555) AS4(26.315,-30.845) BS1(5.785,-4.155) BS2(5.785,-1.445) BS3(26.315,-4.155) BS4(26.315,-1.445)
  rect 1x0.2 smd: C1(1.345,-9.7) C2(4.055,-9.7) C3(1.345,-10.1) C4(4.055,-10.1) C5(1.345,-10.5) C6(4.055,-10.5) C7(1.345,-10.9) C8(4.055,-10.9) C9(1.345,-11.3) C10(4.055,-11.3) C11(1.345,-11.7) C12(4.055,-11.7) C13(1.345,-12.1) C14(4.055,-12.1) C15(1.345,-12.5) C16(4.055,-12.5) C17(1.345,-12.9) C18(4.055,-12.9) C19(1.345,-13.3) C20(4.055,-13.3) C21(1.345,-13.7) C22(4.055,-13.7) C23(1.345,-14.1) C24(4.055,-14.1) C25(1.345,-14.5) C26(4.055,-14.5) C27(1.345,-14.9) C28(4.055,-14.9) C29(1.345,-15.3) C30(4.055,-15.3) C31(1.345,-15.7) C32(4.055,-15.7) C33(1.345,-16.1) C34(4.055,-16.1) C35(1.345,-16.5) C36(4.055,-16.5) C37(1.345,-16.9) C38(4.055,-16.9) C39(1.345,-17.3) C40(4.055,-17.3) C41(1.345,-17.7) C42(4.055,-17.7) C43(1.345,-18.1) C44(4.055,-18.1) C45(1.345,-18.5) C46(4.055,-18.5) C47(1.345,-18.9) C48(4.055,-18.9) C49(1.345,-19.3) C50(4.055,-19.3) C51(1.345,-19.7) C52(4.055,-19.7) C53(1.345,-20.1) C54(4.055,-20.1) C55(1.345,-20.5) C56(4.055,-20.5) C57(1.345,-20.9) C58(4.055,-20.9) C59(1.345,-21.3) C60(4.055,-21.3) C61(1.345,-21.7) C62(4.055,-21.7) C63(1.345,-22.1) C64(4.055,-22.1) C65(1.345,-22.5) C66(4.055,-22.5) C67(1.345,-22.9) C68(4.055,-22.9) C69(1.345,-23.3) C70(4.055,-23.3) C71(1.345,-23.7) C72(4.055,-23.7) C73(1.345,-24.1) C74(4.055,-24.1) C75(1.345,-24.5) C76(4.055,-24.5) C77(1.345,-24.9) C78(4.055,-24.9) C79(1.345,-25.3) C80(4.055,-25.3)
  rect 1x0.35 smd: CS1(1.345,-9.225) CS2(4.055,-9.225) CS3(1.345,-25.775) CS4(4.055,-25.775)
TQFN-16_L3.0-W3.0-P0.50-BL-EP1.7
  rect 0.25x0.75 smd: 1(-0.749,-1.45) 2(-0.248,-1.45) 3(0.252,-1.45) 4(0.751,-1.45) 9(0.75,1.45) 10(0.25,1.45) 11(-0.25,1.45) 12(-0.749,1.45)
  rect 0.75x0.25 smd: 5(1.45,-0.75) 6(1.45,-0.25) 7(1.45,0.25) 8(1.45,0.75) 13(-1.45,0.75) 14(-1.45,0.25) 15(-1.45,-0.25) 16(-1.45,-0.75)
  rect 1.7x1.7 smd: 17(0.001,0)
UFQFPN-48_L7.0-W7.0-P0.50-BL-EP
  oval 0.28x0.9 smd: 1(-2.751,-3.45) 2(-2.251,-3.45) 3(-1.75,-3.45) 4(-1.25,-3.45) 5(-0.749,-3.45) 6(-0.249,-3.45) 7(0.249,-3.45) 8(0.75,-3.45) 9(1.25,-3.45) 10(1.75,-3.45) 11(2.251,-3.45) 12(2.751,-3.45) 25(2.751,3.449) 26(2.251,3.449) 27(1.75,3.449) 28(1.25,3.449) 29(0.75,3.449) 30(0.249,3.449) 31(-0.249,3.449) 32(-0.749,3.449) 33(-1.25,3.449) 34(-1.75,3.449) 35(-2.251,3.449) 36(-2.751,3.449)
  oval 0.9x0.28 smd: 13(3.45,-2.751) 14(3.45,-2.251) 15(3.45,-1.75) 16(3.45,-1.25) 17(3.45,-0.75) 18(3.45,-0.249) 19(3.45,0.249) 20(3.45,0.749) 21(3.45,1.25) 22(3.45,1.75) 23(3.45,2.251) 24(3.45,2.751) 37(-3.449,2.751) 38(-3.449,2.251) 39(-3.449,1.75) 40(-3.449,1.25) 41(-3.449,0.749) 42(-3.449,0.249) 43(-3.449,-0.249) 44(-3.449,-0.75) 45(-3.449,-1.25) 46(-3.449,-1.75) 47(-3.449,-2.251) 48(-3.449,-2.751)
  rect 5.5x5.5 smd: 49(0,0)
USB-C-SMD_TYPE-C-6PIN-2MD-073
  rect 0.55x1.1 smd: 1(-3.2,2.375) 2(-2.4,2.375) 11(2.4,2.375) 12(3.2,2.375)
  rect 0.3x1.1 smd: 3(-1.75,2.375) 4(-1.25,2.375) 5(-0.75,2.375) 6(-0.25,2.375) 7(0.25,2.375) 8(0.75,2.375) 9(1.25,2.375) 10(1.75,2.375)
  oval 1.1x2 hole 0.6x1.5: 13(-4.325,1.825) 14(4.325,1.825)
  oval 1.2x1.8 hole 0.6x1.2: 13(-4.325,-2.375) 14(4.325,-2.375)
WQFN-40_L5.0-W5.0-P0.4-BL-EP
  oval 0.2x0.8 smd: 1(-1.801,-2.499) 2(-1.399,-2.499) 3(-1.001,-2.499) 4(-0.6,-2.499) 5(-0.201,-2.499) 6(0.201,-2.499) 7(0.6,-2.499) 8(1.001,-2.499) 9(1.399,-2.499) 10(1.801,-2.499) 21(1.801,2.499) 22(1.399,2.499) 23(1.001,2.499) 24(0.6,2.499) 25(0.201,2.499) 26(-0.201,2.499) 27(-0.6,2.499) 28(-1.001,2.499) 29(-1.399,2.499) 30(-1.801,2.499)
  oval 0.8x0.2 smd: 11(2.499,-1.801) 12(2.499,-1.399) 13(2.499,-1.001) 14(2.499,-0.6) 15(2.499,-0.201) 16(2.499,0.201) 17(2.499,0.6) 18(2.499,1.001) 19(2.499,1.399) 20(2.499,1.801) 31(-2.499,1.801) 32(-2.499,1.399) 33(-2.499,1.001) 34(-2.499,0.6) 35(-2.499,0.201) 36(-2.499,-0.201) 37(-2.499,-0.6) 38(-2.499,-1.001) 39(-2.499,-1.399) 40(-2.499,-1.801)
  rect 3.8x3.8 smd: 41(0,0)
X2SON-8_L1.4-W1.0-P0.35-BL
  rect 0.175x0.6 smd: 1(-0.525,-0.445)
  rect 0.175x0.53 smd: 2(-0.175,-0.48) 3(0.175,-0.48) 4(0.525,-0.48) 5(0.525,0.48) 6(0.175,0.48) 7(-0.175,0.48) 8(-0.525,0.48)
XFMR-SMD_24P-L15.6-W8.5-P1.27-LS9.5-BL
  rect 0.8x1.55 smd: 1(-6.985,-4.475) 2(-5.715,-4.475) 3(-4.445,-4.475) 4(-3.175,-4.475) 5(-1.905,-4.475) 6(-0.635,-4.475) 7(0.635,-4.475) 8(1.905,-4.475) 9(3.175,-4.475) 10(4.445,-4.475) 11(5.715,-4.475) 12(6.985,-4.475) 13(6.985,4.475) 14(5.715,4.475) 15(4.445,4.475) 16(3.175,4.475) 17(1.905,4.475) 18(0.635,4.475) 19(-0.635,4.475) 20(-1.905,4.475) 21(-3.175,4.475) 22(-4.445,4.475) 23(-5.715,4.475) 24(-6.985,4.475)
XFMR-SMD_TCM1-63AX
  rect 0.76x1.65 smd: 1(-1.27,1.59) 2(0,1.59) 3(1.27,1.59) 4(1.27,-1.59) 5(0,-1.59) 6(-1.27,-1.59)

## Nets
As in the schematic, except:
5V: 100M.2 1000M.2 ACT.2 C10.2 C11.2 C83.1 C84.2 C122.1 C123.2 C124.2 C141.1 C144.1 C147.2 F1.2 H1.1 Q7.2 R15.1 R24.2 R25.2 R78.2 R84.2 U3.2 U7.1 U7.3 U8.B89 U8.B91 U8.B93 U8.B95 U8.B97 U8.B99 U10.3 U10.9 U11.15 U12.1 U12.3 U13.1 U13.3
GND: ARM RST.3 C1.1 C2.2 C3.1 C4.1 C5.1 C6.1 C8.1 C10.1 C11.1 C15.1 C16.1 C17.1 C19.1 C20.1 C21.1 C24.1 C26.1 C29.1 C30.1 C31.1 C34.1 C36.1 C37.1 C38.2 C39.1 C40.2 C55.2 C58.1 C59.1 C61.1 C62.1 C63.1 C65.1 C66.1 C67.1 C68.1 C69.1 C70.1 C71.1 C72.1 C73.1 C74.1 C75.1 C76.1 C79.1 C81.1 C82.2 C83.2 C84.1 C85.1 C86.1 C87.1 C94.1 C95.1 C98.1 C99.1 C106.2 C107.2 C108.2 C109.2 C110.1 C111.1 C112.1 C113.1 C114.1 C115.1 C116.1 C117.1 C119.1 C120.1 C121.2 C122.2 C123.1 C124.1 C125.1 C126.1 C130.2 C131.1 C132.1 C133.2 C134.2 C135.1 C136.1 C137.1 C138.1 C139.2 C140.2 C141.2 C144.2 C145.1 C146.2 C147.1 C148.1 C149.1 C150.1 C151.1 C153.1 C154.2 C155.2 C156.2 C157.2 CN1.10 D3.2 H1.4 H2.2 H3.2 H4.2 L11.1 L11.2 L11.5 L12.1 L12.2 L12.5 L13.1 L13.2 L13.5 L16.1 L16.2 L16.5 NC.2 OSC1.2 Q1.2 Q2.2 Q3.2 Q4.2 Q5.2 Q6.2 R8.1 R13.1 R18.1 R22.2 R23.1 R26.1 R28.1 R30.2 R31.2 R32.2 R33.2 R46.2 R60.1 R61.2 R64.2 R65.2 R67.2 R68.2 R69.2 R75.2 R80.2 RF1.1 RF1.2 RF1.3 RF1.4 RF2.1 RF2.2 RF2.3 RF2.4 RF3.1 RF3.2 RF3.3 RF3.4 RF4.1 RF4.2 RF4.3 RF4.4 RF5.1 RF5.2 RF5.3 RF5.4 RF6.1 RF6.2 RF6.3 RF6.4 RF7.1 RF7.2 RF7.3 RF7.4 U1.8 U1.23 U1.35 U1.47 U1.49 U2.A4 U2.A6 U2.A12 U2.B1 U2.B2 U2.B12 U2.C1 U2.C2 U2.C4 U2.C7 U2.C8 U2.C9 U2.C10 U2.C11 U2.C12 U2.D1 U2.D12 U2.E1 U2.F1 U2.F3 U2.F7 U2.F9 U2.F11 U2.G1 U2.G12 U2.H1 U2.H2 U2.H3 U2.H5 U2.H6 U2.H7 U2.H10 U2.J1 U2.J2 U2.K1 U2.K2 U2.K12 U2.L1 U2.L2 U2.L3 U2.L7 U2.L8 U2.L9 U2.L10 U2.L11 U2.L12 U2.M4 U2.M6 U3.1 U3.4 U5.6 U5.17 U6.6 U6.17 U7.2 U8.A2 U8.A3 U8.A8 U8.A9 U8.A14 U8.A15 U8.A20 U8.A21 U8.A26 U8.A27 U8.A32 U8.A33 U8.A38 U8.A39 U8.A45 U8.A46 U8.A51 U8.A57 U8.A63 U8.A69 U8.A70 U8.A75 U8.A76 U8.A81 U8.A82 U8.A87 U8.A88 U8.A93 U8.A94 U8.A99 U8.A100 U8.AS1 U8.AS2 U8.AS3 U8.AS4 U8.B47 U8.B53 U8.B59 U8.B65 U8.B77 U8.B79 U8.B81 U8.B83 U8.B85 U8.B87 U8.B100 U8.BS1 U8.BS2 U8.BS3 U8.BS4 U8.C1 U8.C2 U8.C8 U8.C11 U8.C16 U8.C17 U8.C21 U8.C22 U8.C27 U8.C35 U8.C38 U8.C60 U8.C63 U8.C66 U8.CS1 U8.CS2 U8.CS3 U8.CS4 U9.41 U10.2 U10.17 U11.17 U12.2 U13.2 U15.33 U16.4 USB1.1 USB1.12 USB1.13 USB1.14 X1.2 X1.4 X2.2 X2.4 X3.2 X3.4 X4.2 X4.4
ARM_NRST: ARM RST.2 C8.2 R1.2 U1.7
$3N6807: PG B.2 R24.1
$3N6848: PG A.2 R25.1
$3N21957: PG B.1 Q2.3
$3N22008: PG A.1 Q3.3
$4N3637: ARM.2 R84.1
$4N6007: ARM.1 Q1.3
$7N8958: 10M.1 R61.1
$7N8975: 100M.1 R62.1
$7N8992: 1000M.1 R63.1
$7N9856: ACT.1 R76.1
$7N52042: 10M.2 Q7.3

Pads without a net: ARM RST 1 4; CN1 2 6 7 8; OSC1 1; SCREW1 1; SCREW2 1; SCREW3 1; SCREW4 1; U1 3 4 18 19 20 25 38 40 41 43 44 45 46; U2 A3 M3 M11; U5 8; U6 8; U7 4; U9 35; U10 10 11 12 13 14 15 16; U11 3 4 5 6 13 14; U12 4; U13 4; U15 12 15 16 17; USB1 3 9

## Via types
v1: diameter 0.399, hole 0.299, Top Layer to Bottom Layer, 1564 vias
v2: diameter 0.4, hole 0.3, Top Layer to Bottom Layer, 6 vias

## Routing (per net, layer and track width the routed paths; a pad name or vN(x,y) marks a point on that pad's centre or on a via; arc(x,y) is an arc through that point)
1V3_A: length 89.1
  Top Layer w0.381: v1(82.72,29.5) v1(82.72,28.7) ; U2.B9 v1(76.32,26.3) ; R12.2 v1(63.88,48.59) ; 81.92,31.9 v1(81.92,32.7)
  Inner3 w0.203: v1(63.88,48.59) 61.32,48.59
  Inner3 w0.381: v1(70.49,24.31) 70.1,24.69 70.1,28 71.37,29.27 71.37,31.04 72.9,32.57 72.9,33.89 72.29,34.5 64.87,34.5 60.58,38.79 60.58,45.27 ; v1(61.11,50.82) 61.27,50.98 74.04,50.98 76.2,48.82 81.41,48.82 82.55,47.68 82.55,33.33 v1(81.92,32.7) 82.17,32.45 82.17,30.05 v1(82.72,29.5)
  Bottom Layer w0.381: C61.2 82.77,32.81 ; 82.77,32.81 82.66,32.7 v1(81.92,32.7) ; 82.77,32.81 82.77,33.6 C62.2 ; v1(70.49,24.31) 73.03,24.31 73.19,24.48 C65.2 ; v1(76.32,26.3) 73.2,26.3 73.19,26.29
  Bottom Layer w0.508: C65.2 C63.2
  vias: v1(60.23,50.83) v1(60.2,49.81) v1(60.2,49.03) v1(60.2,48.19) v1(60.2,47.32) v1(60.2,46.44) v1(60.2,45.63) v1(61.13,49.72) v1(61.18,48.3) v1(61.18,47.31) v1(61.18,46.54) v1(61.18,45.66) v1(61.26,48.98)
1V3_B: length 124.8
  Top Layer w0.152: R17.2 70.98,48.57 v1(70.1,48.57)
  Top Layer w0.381: U2.M9 v1(76.32,34.3) ; L18.1 83.42,15.8 v1(83.44,15.8) ; v1(70.99,25.46) C71.2 71.87,25.48 C66.2 ; 81.92,28.7 v1(81.92,27.9) U2.D2 ; 77.63,14.31 77.63,15.77 77.12,16.28 v1(77.12,25.5) v1(76.32,25.5)
  Top Layer w0.508: 77.63,14.31 79.14,15.82
  Top Layer w0.762: C98.2 77.79,14 v1(77.63,14.15)
  Inner3 w0.152: 81.53,34.73 81.53,33.11 v1(81.12,32.7) 81.53,32.29 81.53,28.29 v1(81.92,27.9)
  Inner3 w0.381: 72.64,29.14 74.36,29.14 v1(74.72,29.5) ; 72.64,29.14 72.64,31.17 73.43,31.96 73.43,35.42 71.62,37.23 67.94,37.23 67.56,37.61 67.56,47.68 67.44,47.81 ; 72.64,29.14 70.99,27.49 v1(70.99,25.46) 70.99,25.2 71.5,24.69 75.31,24.69 76.12,25.5 v1(76.32,25.5) ; v1(83.44,15.8) 79.28,15.8 v1(77.63,14.15) ; 81.53,35.11 77.09,35.11 76.32,34.34 v1(76.32,34.3) ; 81.53,35.11 81.53,46.03 80.83,46.74 v1(75.02,46.74) ; 81.53,35.11 81.53,34.73 ; v1(75.02,46.74) 71.18,46.74 70.1,47.81 v1(70.1,48.57) 67.82,48.57 ; v1(75.02,46.74) 75.02,46.65 v1(76.59,45.08) 80.86,45.08 ; v1(75.02,46.74) 75.22,46.94 v1(75.22,48.4)
  Bottom Layer w0.152: v1(81.12,32.7) 81.53,33.11 81.53,34.73 81.66,34.85 C67.2
  Bottom Layer w0.254: v1(81.92,27.9) 82.46,27.36 C70.2 ; C73.2 76.54,24.01 77.12,24.6 v1(77.12,25.5) ; C72.2 76.02,25.2 v1(76.32,25.5)
  Bottom Layer w0.381: C68.2 C69.2 76.64,34.62 v1(76.32,34.3)
  Bottom Layer w0.508: C70.2 C75.2 ; C67.2 C74.2
  vias: v1(67.04,48.06) v1(67.08,49.69) v1(67.08,48.89) v1(67.73,48.89) v1(67.73,47.99) v1(67.88,49.67) v1(80.87,45.08)
1V8: length 157.5
  Top Layer w0.152: v1(58.42,6.28) 58.04,5.9 R1.1 ; U8.B1 v1(30.23,13.75) ; U8.C29 40.3,9.52 40.15,9.67 v1(39.68,9.67)
  Top Layer w0.158: v1(69.44,4.77) 69.36,4.69 67.12,4.69 65.98,3.55 v1(60.69,3.55) U16.1
  Top Layer w0.203: C5.2 63.3,13.75 U8.A1 v1(57.15,13.75)
  Top Layer w0.254: U1.48 69.14,4.14 C4.2 69.18,4.07 69.66,4.07 69.84,4.25 69.84,6.18 ; 63.64,12.38 63.64,13.55 C5.2 ; C28.2 60.26,31.62 59.69,32.19 59.69,35.23 60.1,35.64 R10.2 v1(60.63,36.5) ; 69.84,10.18 v1(70.61,10.18) ; 61.47,5.94 61.47,6.19 v1(61.58,6.3) 61.71,6.18 62.94,6.18
  Top Layer w0.381: U6.4 71.8,42.56 72.48,41.88 R16.2 74.6,41.88 L10.2 ; 66.84,41.8 66.34,41.8 65.62,42.52 64.75,42.52
  Inner3 w0.152: v1(58.42,6.28) 61.56,6.28 v1(61.58,6.3)
  Inner3 w0.203: 74.04,35.54 74.12,35.62 79.63,35.62 79.87,35.86 v1(79.87,36.99)
  Inner3 w0.381: v1(70.61,10.18) 70.19,10.18 69.85,9.84 69.85,5.54 v1(69.89,5.5) 69.89,5.22 v1(69.44,4.77) 67.45,4.77 66.8,4.12 62.48,4.12 61.58,5.02 v1(61.58,6.3) 61.58,9.32 v1(57.15,13.75) 57,13.9 55.63,13.9 54.9,14.62 ; v1(55.12,35.11) 53.59,33.58 53.59,15.93 54.9,14.62 ; v1(30.23,13.75) 33.68,13.75 37.76,9.67 v1(39.68,9.67) 41.62,9.67 43.56,11.61 51.89,11.61 54.9,14.62 ; v1(72.01,38.39) 72.01,37.59 73.97,35.64 73.97,35.62 74.04,35.54 v1(74.04,34.09) 74.04,31.55 74.49,31.1 v1(74.72,31.1)
  Bottom Layer w0.158: v1(61.58,6.3) 61.58,5.71 R91.1 ; C153.2 59.66,3.55 v1(60.69,3.55)
  Bottom Layer w0.254: v1(71.88,39.81) 71.5,40.19 60.96,40.19 60.63,39.86 v1(60.63,36.5)
  Bottom Layer w0.508: v1(74.04,34.09) 73.85,34.28 73.85,36.76
  vias: v1(55.07,37.78) v1(55.13,36.77) v1(55.13,35.87) v1(55.94,35.11) v1(55.99,37.78) v1(55.97,36.77) v1(56,35.87) v1(56.74,35.87) v1(56.7,35.11) v1(56.77,37.78) v1(56.77,36.76) v1(57.6,36.76) v1(57.58,35.87) v1(57.57,35.11) v1(58.18,36.5) v1(58.42,35.87) v1(58.44,35.11) v1(61.76,39.57) v1(61.75,38.83) v1(62.08,38.09) v1(62.55,39.58) v1(62.55,38.92) v1(62.87,38.11) v1(68.38,39.31) v1(68.4,38.38) v1(69.15,38.43) v1(69.19,39.31) v1(70.13,39.3) v1(70.22,38.34) v1(70.84,39.35) v1(71,38.36) v1(71.96,39.06)
3V3: length 97.1
  Top Layer w0.152: v1(82.93,22.79) 82.04,22.79 81.61,23.22 81.61,23.61 81.15,24.06 81.15,24.64 80.74,25.04 80.74,26.47 80.53,26.69 78.31,26.69 v1(77.92,26.3)
  Top Layer w0.158: v1(60.58,1.71) 60.22,2.07 U16.8
  Top Layer w0.381: v1(75.95,17.07) 73.03,17.07 72.71,17.39 U7.5 73.09,18.62 C82.1
  Inner3 w0.158: 60.62,0.44 60.58,0.48 v1(60.58,1.71)
  Inner3 w0.203: 50.71,0.44 49.53,0.44 48.9,1.07 48.9,5.03 48.15,5.77 35.94,5.77 35.18,5.01 35.18,1.99 v1(34.75,1.56) ; 50.71,0.44 72.64,0.44 75.31,3.1 75.31,16.44 v1(75.95,17.07) ; 50.71,0.44 50.74,0.47 v1(50.74,1.58)
  Bottom Layer w0.158: R88.2 31.23,1.55 R86.2
  Bottom Layer w0.203: v1(34.75,1.56) 34.74,1.55 R86.2
  Bottom Layer w0.381: v1(60.58,1.71) 60.07,1.2 C154.1 ; C85.2 79.59,17.07 v1(75.95,17.07)
  Bottom Layer w0.508: 82.9,22.82 82.93,22.79 ; C85.2 C86.2 82.92,22.76 C87.2
5V: length 274.3
  Top Layer w0.152: v1(69.39,32.94) 69.47,32.94 C11.2 ; 1.4,51.62 1.6,51.62 ; R78.2 20.32,0.82 19.94,0.44 15.37,0.44 v1(14.92,0.88) ; 61.78,35.64 v1(61.78,36.25)
  Top Layer w0.158: R84.2 73.2,3.31 73.03,3.49 v1(72.14,3.49)
  Top Layer w0.254: C144.1 9.61,6.32 10.01,5.92 U11.15 ; R24.2 61.59,56.03 61.59,55.43 61.42,55.25 57.59,55.25 ; 57.59,55.25 57.54,55.3 R25.2 ; 57.59,55.25 57.22,55.25 56.77,54.79 v1(56.77,53.4) ; U10.9 16.13,10.33 v1(16.13,9.84) ; U7.3 74.61,14.72 74.42,14.53 72.9,14.53 72.71,14.72 U7.1
  Top Layer w0.381: v1(72.01,14.53) 72.01,15.73 72.02,15.74 ; U12.1 18.69,15.15 18.29,15.55 18.29,16.68 18.66,17.05 U12.3 ; U13.3 19.88,20.58 19.56,20.25 19.56,18.98 19.86,18.68 U13.1 ; 1000M.2 1.6,48.78 v1(1.52,48.7) ; 100M.2 1.6,49.97 ; v1(25.4,46.03) 25.4,46.79 24.89,47.3 ACT.2
  Top Layer w0.508: C122.1 22.98,15.15 U12.1 ; C124.2 22.11,18.68 U13.1 ; U7.1 72.62,15.74 C84.2 68.13,15.74 v1(68.07,15.8)
  Inner2 w0.152: v1(61.78,36.25) 62.04,36.5 66.11,36.5 69.39,33.22 v1(69.39,32.94)
  Inner3 w0.152: 9.02,6.27 9.02,5.14 9.65,4.5 13.84,4.5 14.48,3.87 14.48,1.33 v1(14.92,0.88)
  Inner3 w0.158: v1(72.14,3.49) 71.12,3.49 70.87,3.74
  Inner3 w0.254: v1(56.77,53.4) 56.77,39.3 56.9,39.17
  Inner3 w0.381: 8.27,6.32 9.05,6.32 ; v1(1.83,37.78) 1.83,41.66 1.02,42.47 1.02,47.68 1.52,48.19 v1(1.52,48.7) ; v1(9.05,6.3) 9.92,6.3 11.18,7.55 11.18,10.34 ; H1.1 62.48,2.85 62.74,3.1 70.23,3.1 70.87,3.74 70.87,8.31 72.01,9.45 v1(72.01,14.53) ; v1(25.4,46.03) 25.4,39.17
  Inner3 w0.508: v1(69.39,32.94) 63.13,32.94 56.9,39.17 24.38,39.17 ; 24.38,32.48 24.38,29.27 23.5,28.38 20.7,28.38 19.94,27.61 19.94,22.28 18.92,21.27 16.38,21.27 10.86,15.74 v1(10.86,11.19) ; 24.38,32.48 24.46,32.56 29.88,32.56 29.89,32.56 ; 24.38,32.48 24.38,39.17 ; v1(68.07,15.8) 68.07,32.56 67.69,32.94 ; 2.03,39.17 24.38,39.17
  Bottom Layer w0.254: v1(11.63,10.49) 12.29,9.84 v1(16.13,9.84)
  Bottom Layer w0.381: 11.81,10.85 11.83,10.84 12.92,10.84 13.19,11.1 13.19,11.72 13.97,12.5 15.62,12.5 16.89,13.77 v1(19.56,13.77) ; Q7.2 v1(1.83,37.78)
  vias: v1(8.28,6.31) v1(9.42,10.49) v1(9.46,11.17) v1(10.15,11.19) v1(10.17,10.51) v1(10.88,10.53) v1(11.6,11.21) v1(20.3,13.77) v1(21.05,13.77) v1(21.87,13.77) v1(22.73,13.77) v1(23.71,13.77) v1(24.44,13.77) v1(29.86,33.15) v1(29.87,32.55) v1(29.89,31.88) v1(30.56,33.14) v1(30.57,32.54) v1(30.59,31.89) v1(70.01,33.32) v1(70.02,32.69) v1(70.81,33.31) v1(70.82,32.7) v1(71.49,33.3) v1(71.51,32.7) v1(72.23,33.3) v1(72.15,32.69)
GND: length 283.9
  Top Layer w0.152: R33.2 63.99,21.27 v1(63.75,21.27) ; U8.C21 38.7,9.8 38.95,10.05 40.75,10.05 41.5,9.3 U8.C35 ; v1(62.23,15.3) 62.1,15.42 60.96,15.42 60.71,15.17 59.94,15.17 59.76,15.35 U8.A9 ; R32.2 63.97,19.52 63.75,19.74 v1(63.75,20.12) ; 10.29,27.67 10.14,27.81 v1(9.98,27.81)
  Top Layer w0.158: U16.4 59.16,4.99 v1(59.18,5.01)
  Top Layer w0.203: U8.A32 v1(54.74,19.75) ; v1(57.02,16.44) 56.73,16.15 U8.A14 ; 38.7,6.57 38.66,6.53 37.86,6.53 ; 38.7,6.57 38.74,6.53 39.9,6.53 ; 38.7,6.57 U8.C21 ; U8.B47 v1(29.97,22.95) ; U8.C11 36.7,6.56 36.72,6.53 37.86,6.53 ; U8.A8 55.25,14.95 54.99,15.2 v1(54.99,15.68) ; U8.AS4 v1(57.19,33.81) U8.AS3 ; U8.A63 57.66,26.15 v1(57.65,26.15) ; 72.77,33.97 73.24,33.5 74.28,33.5 74.31,33.53 74.65,33.53 74.68,33.5 U2.L12 ; v1(50.78,7.93) U8.CS3 U8.CS4 ; U8.A3 57.32,14.15 57.32,14.15 57.28,14.15 v1(56.9,14.53) 56.38,14.02 56.38,13.97 56.16,13.75 U8.A2 U8.AS2 U8.AS1 ; U8.C63 47.1,8.17 46.86,7.93 v1(46.86,7.55) ; U8.A38 v1(54.74,20.95) ; 37.86,6.53 37.9,6.57 U8.C17 ; U8.A94 55.81,32.19 v1(54.74,32.19) ; v1(57.65,26.87) 58.15,27.36 58.54,27.36 ; U8.A87 v1(59.44,30.95) ; U8.A57 v1(57.66,24.95) ; v1(41.78,12.88) 41.78,12.25 41.9,12.13 U8.C38 ; U8.C2 34.7,12.47 34.53,12.65 34.24,12.65 34.22,12.63 ; U8.A81 v1(59.44,29.75) ; U8.A46 v1(54.74,22.55) ; U8.A21 v1(59.56,17.75) ; U8.B59 30.12,25.35 v1(30.48,25.71) ; U8.C16 v1(37.5,12.63) ; U8.A82 v1(54.74,29.75) ; U8.A15 v1(59.56,16.55) ; U8.B53 v1(29.97,24.15) ; U8.C27 39.9,8.18 39.9,8.18 39.9,6.53 ; U8.A45 v1(59.18,22.55) ; U8.B100 v1(25.65,33.35) ; U8.A39 v1(59.44,21.35) ; 39.9,6.53 44.32,6.53 v1(44.58,6.28) ; v1(54.61,27.36) 55.83,27.36 U8.A70 ; U8.C8 v1(35.9,12.63) ; U8.A26 v1(54.74,18.55) ; U8.A20 v1(57.02,17.35) ; U8.A93 v1(57.66,32.15) ; U8.B65 v1(29.97,26.55) ; U8.C1 34.7,7.8 34.34,7.45 34.22,7.45 ; U8.C60 v1(46.3,17.96) ; U8.BS4 v1(27.79,33.81) U8.BS3 ; U1.47 68.64,6.68 U1.49 ; U8.C22 v1(38.7,12.63) ; 57.19,28.55 U8.A76 ; 57.19,28.55 U8.A75 ; 57.19,28.55 v1(57.19,29.01) ; U8.A88 v1(54.74,30.95) ; U8.A33 v1(57.53,20.15) ; U8.A99 v1(57.66,33.35) ; U8.A100 v1(54.74,33.35) ; U8.C66 v1(47.5,17.96) ; U8.A51 v1(59.31,23.75) ; U8.A27 v1(59.18,18.95)
  Top Layer w0.254: U8.CS2 34.22,12.63 v1(33.4,12.63) ; v1(79.52,34.3) U2.L7 U2.L9 U2.L10 U2.L12 ; v1(73.73,29.87) 74.16,30.3 U2.G12 ; 69.84,9.68 67.14,9.68 U1.49 ; v1(29.72,1.2) 31.3,1.2 33.72,3.61 33.72,6.94 34.22,7.45 U8.CS1 ; 28.26,13.28 U8.BS1 ; 28.26,13.28 U8.BS2 ; 28.26,13.28 28.25,13.3 v1(28.25,13.72) ; 54.06,5.9 v1(54.06,7.93) ; X3.4 29.09,3.07 C134.2 ; U10.2 14.43,11.33 14.68,11.08
  Top Layer w0.28: 64.14,12.38 64.14,11.18 64.85,10.47 ; 62.94,6.68 64.14,6.68 U1.49
  Top Layer w0.305: C20.1 66.57,44.2 U5.6 64,44.2 U5.17 ; U6.6 72.99,44.18 73.12,44.05
  Top Layer w0.381: v1(83.52,32.7) v1(83.52,33.5) U2.L2 ; v1(83.52,32.7) U2.K2 ; v1(83.52,32.7) v1(83.52,31.9) ; 73.12,44.05 v1(73.91,44.05) ; C122.2 23.09,16.78 22.87,16.57 21.97,16.57 v1(21.85,16.44) v1(21.21,16.44) ; v1(72.14,40.7) 71.65,41.18 C29.1 ; v1(72.19,49.46) R18.1 73.62,48.61 C94.1 ; C1.1 64.6,14.91 C5.1 62.99,15.3 v1(62.23,15.3) ; C99.1 76.54,12.78 v1(76.39,12.63) ; C66.1 72.96,25.48 72.94,25.46 72.94,24.86 v1(71.75,23.68) ; v1(24.18,8.83) 24.38,9.03 24.38,9.96 24.22,10.13 C135.1 ; C4.1 68.03,3.27 v1(68.83,2.47) ; C3.1 72.48,4.92 72.9,4.5 v1(73.41,4.5) ; v1(71.5,6.92) 71.76,6.92 X1.2 71.71,7.8 v1(71.5,7.8) ; C94.1 v1(73.82,49.33) ; C94.1 73.93,48.29 C95.1 ; v1(16.76,16.19) 16.04,16.19 C121.2 14.99,17.24 C114.1 ; C141.2 v1(12.06,9.07) ; v1(16.9,20.06) 16.75,20.21 C125.1 16.24,20.34 16.24,20.87 16.51,21.14 17.02,21.14 18.02,22.14 C119.1 18.03,22.71 C120.1 ; v1(16.89,4.23) 16.02,4.23 15.75,4.5 C137.1 ; v1(64.77,49.71) 65.66,49.71 65.77,49.6 R13.1 ; 78.72,27.11 74.73,27.11 U2.C12 U2.B12 v1(74.72,25.5) ; C55.2 v1(73.91,43.15) ; C144.2 9.02,4.88 8.51,4.37 v1(8.13,4.37) ; 64.85,10.47 U1.49 ; C83.2 71.12,17.14 C84.1 68.39,17.14 v1(67.25,15.99) ; 73.54,11.54 v1(74.42,11.54) ; 81.92,31.1 v1(82.72,31.1) ; v1(72.52,22.03) 72.86,22.03 C37.1 74.64,22.53 C38.2 74.49,22.13 C82.2 ; C140.2 13.75,13.3 v1(13.59,13.14) ; v1(65.91,40.82) 65.53,41.2 C19.1 ; C112.1 C113.1 22.77,20.73 v1(22.36,20.32) ; C6.1 v1(62.87,4.84) ; v1(83.52,27.9) 83.52,27.82 v1(83.98,27.36) 83.72,27.1 U2.C2 U2.B2 83.52,26.3 ; v1(83.52,31.9) 83.52,31.13 ; v1(83.52,31.9) U2.J2
  Top Layer w0.508: USB1.12 6.78,7.23 6.78,6.65 ; USB1.1 6.78,14.73 USB1.13
  Bottom Layer w0.203: R69.2 v1(28.33,24.19) 29.93,24.19 v1(29.97,24.15) ; v1(71.56,36.58) 72.28,36.58 72.45,36.76
  Bottom Layer w0.254: Q5.2 v1(1.75,47.55) ; C154.2 v1(57.66,1.2) ; 1.76,42.91 1.88,42.91 v1(2.6,43.62)
  Bottom Layer w0.381: C74.1 C67.1 C61.1 84.37,31.93 v1(85.34,31.93) ; R22.2 81.19,37.61 80.65,38.16 ; C132.1 22.36,3.1 22.62,2.85 v1(22.62,1.71) ; 72.45,36.76 72.61,36.6 v1(72.61,35.36) 72.61,34.22 ; Q3.2 57.98,54.1 v1(57.66,53.78) ; 83.99,22.82 83.99,21.54 84.02,21.51 ; R64.2 24.83,17.59 R65.2 24.82,16.25 25.15,15.93 v1(25.65,15.93) ; C65.1 C63.1 70.61,26.6 69.72,25.71 69.72,23.93 v1(70.23,23.42) ; C72.1 74.62,25.18 C73.1 73.9,23.3 v1(72.52,23.3) ; Q1.2 74.85,3.49 v1(74.29,3.49) ; v1(9.91,16.06) 10.54,16.06 11.09,16.6 C109.2 ; C69.1 C68.1 77.73,37.52 76.58,38.66 v1(76.58,41.08) ; v1(24.51,45.39) 24.51,44.56 Q6.2 ; RF1.4 72.53,52.39 71.7,51.56 ; C75.1 v1(83.98,27.36) ; R61.2 v1(2.36,54.41) ; Q2.2 63.25,54.24 v1(63.25,55.05) ; C153.1 56.77,3.61 56.01,4.37 v1(56.01,4.88) ; 14.94,30.18 v1(14.51,30.18)
  vias: v1(0.62,30.96) v1(0.61,30.35) v1(0.6,29.74) v1(0.62,29.08) v1(0.64,28.48) v1(0.65,27.86) v1(0.64,27.26) v1(0.65,25.41) v1(0.64,24.11) v1(0.61,23.44) v1(0.63,22.7) v1(0.66,26.65) v1(0.67,26.04) v1(0.7,24.81) v1(0.67,22.09) v1(0.7,21.47) v1(1.02,54.41) v1(0.98,31.44) v1(1.09,20.98) v1(1.12,13.59) v1(1.32,7.81) v1(1.43,35.2) v1(1.42,33.8) v1(1.41,31.89) v1(1.44,17.93) v1(1.49,20.52) v1(1.49,16.78) v1(1.94,32.41) v1(1.91,30.08) v1(1.91,29.39) v1(1.91,28.63) v1(1.91,27.95) v1(1.91,27.3) v1(1.91,26.66) v1(1.91,25.93) v1(1.91,25.24) v1(1.91,24.52) v1(1.91,23.83) v1(1.91,22.94) v1(1.97,20.01) v1(2.23,30.66) v1(2.41,22.15) v1(2.4,19.55) v1(2.57,32.52) v1(2.74,31.17) v1(2.82,17.96) v1(2.76,16.8) v1(2.77,13.59) v1(2.92,21.65) v1(2.93,19.25) v1(2.96,36.66) v1(3.01,28.27) v1(3.03,27.6) v1(3.03,26.94) v1(3.05,26.29) v1(3.04,25.51) v1(3.06,28.93) v1(3.23,32.53) v1(3.16,24.81) v1(3.32,29.51) v1(3.26,7.82) v1(3.38,33.83) v1(3.54,31.3) v1(3.56,21.27) v1(3.56,19.22) v1(3.66,24.11) v1(3.8,29.93) v1(3.94,47.81) v1(3.88,32.51) v1(4,35.88) v1(3.96,10.6) v1(4.15,31.32) v1(4.22,27.79) v1(4.24,27.17) v1(4.19,19.2) v1(4.32,37.74) v1(4.28,28.41) v1(4.26,26.56) v1(4.31,23.62) v1(4.43,29.99) v1(4.35,21.27) v1(4.51,32.52) v1(4.53,25.99) v1(4.75,41.89) v1(4.75,40.81) v1(4.69,10.6) v1(4.81,31.32) v1(4.78,28.83) v1(4.83,19.2) v1(4.87,23.3) v1(5.02,25.65) v1(5.07,32.75) v1(5.07,16.44) v1(5.2,30.03) v1(5.42,31.29) v1(5.47,33.23) v1(5.5,28.9) v1(5.61,37.85) v1(5.8,30.05) v1(6.01,31.59) v1(6.21,28.89) v1(6.34,41.81) v1(6.32,40.76) v1(6.32,17.98) v1(6.36,32.09) v1(6.43,30.05) v1(6.37,17.02) v1(6.56,31.25) v1(6.73,32.6) v1(6.85,28.88) v1(6.88,37.88) v1(7.04,30.07) v1(7.11,33.14) v1(7.14,19.25) v1(7.21,26.03) v1(7.2,25.07) v1(7.16,5.14) v1(7.24,1.51) v1(7.32,23.91) v1(7.29,22.77) v1(7.25,21.33) v1(7.3,20.62) v1(7.38,31.26) v1(7.41,27.76) v1(7.49,28.89) v1(7.64,30.05) v1(7.62,25.53) v1(7.65,23.34) v1(7.79,21.69) v1(7.85,19.27) v1(7.87,17.16) v1(8.03,27.78) v1(8.13,28.88) v1(8.07,27.11) v1(8.18,31.26) v1(8.24,30.05) v1(8.33,19.77) v1(8.54,26.55) v1(8.52,20.35) v1(8.69,27.78) v1(8.81,28.89) v1(8.78,25.82) v1(8.76,1.67) v1(8.86,20.87) v1(8.99,31.26) v1(9.14,17.23) v1(9.3,27.79) v1(9.48,28.89) v1(10.15,28.9) v1(10.23,22.26) v1(10.24,21.65) v1(10.31,24.72) v1(10.3,24.11) v1(10.29,23.48) v1(10.25,22.88) v1(10.64,33.17) v1(10.68,32.55) v1(10.66,31.93) v1(10.73,3.34) v1(10.71,2.7) v1(10.75,28.9) v1(10.92,22.88) v1(10.9,22.26) v1(10.91,21.65) v1(10.98,24.72) v1(10.97,24.11) v1(10.96,23.48) v1(11.29,6.83) v1(11.29,6.2) v1(11.29,5.53) v1(11.36,28.89) v1(11.53,22.27) v1(11.54,21.65) v1(11.48,3.34) v1(11.47,2.7) v1(11.6,24.73) v1(11.59,24.11) v1(11.58,23.49) v1(11.55,22.88) v1(11.9,33.06) v1(11.89,32.45) v1(11.88,31.84) v1(11.9,6.8) v1(11.9,6.17) v1(11.89,5.51) v1(12.14,22.26) v1(12.21,24.72) v1(12.2,24.11) v1(12.19,23.48) v1(12.16,22.88) v1(12.15,21.65) v1(12.51,6.8) v1(12.51,6.17) v1(12.51,5.5) v1(12.85,23.48) v1(12.81,22.87) v1(12.79,22.26) v1(12.8,21.64) v1(12.87,24.72) v1(12.86,24.11) v1(12.88,1.71) v1(12.89,1.02) v1(13.04,27.83) v1(13.1,30.46) v1(13.22,32.99) v1(13.25,32.37) v1(13.25,31.73) v1(13.26,31.11) v1(13.42,22.88) v1(13.4,22.26) v1(13.41,21.65) v1(13.48,24.72) v1(13.47,24.11) v1(13.46,23.48) v1(13.66,1.73) v1(13.68,1.02) v1(14.09,11.69) v1(14.09,11.06) v1(14.1,10.46) v1(14.35,7.77) v1(14.48,32.69) v1(14.5,32.09) v1(14.5,31.47) v1(14.52,30.85) v1(14.7,11.67) v1(14.7,11.06) v1(14.71,10.43) v1(15.33,11.68) v1(15.31,11.05) v1(15.32,10.43) v1(15.5,27.31) v1(15.58,1.85) v1(15.87,28.88) v1(16.54,27.81) v1(16.57,28.92) v1(16.95,1.89) v1(17.14,29.12) v1(17.24,27.81) v1(17.54,29.56) v1(17.84,27.99) v1(17.78,12.03) v1(17.99,29.97) v1(18.16,8.44) v1(18.24,7.79) v1(18.24,7.05) v1(18.24,6.35) v1(18.24,5.61) v1(18.35,32.95) v1(18.29,28.45) v1(18.37,32.35) v1(18.37,31.69) v1(18.39,31.06) v1(18.38,30.45) v1(18.78,28.9) v1(18.77,8.44) v1(18.85,7.79) v1(18.85,7.05) v1(18.85,6.35) v1(18.85,5.61) v1(19.05,1.54) v1(19.26,29.38) v1(19.3,16.1) v1(19.55,8.44) v1(19.61,31.38) v1(19.59,30.72) v1(19.6,30.03) v1(19.62,7.79) v1(19.62,7.05) v1(19.62,6.35) v1(19.62,5.61) v1(19.67,32.68) v1(19.9,32.09) v1(19.99,16.1) v1(20.24,8.44) v1(20.28,19.63) v1(20.32,7.79) v1(20.32,7.05) v1(20.32,6.35) v1(20.32,5.61) v1(20.94,8.44) v1(20.95,19.63) v1(21.02,7.79) v1(21.02,7.05) v1(21.02,6.35) v1(21.02,5.61) v1(21.34,1.54) v1(22.74,26.82) v1(22.77,32.69) v1(22.77,31.55) v1(22.77,30.41) v1(22.77,25.58) v1(22.77,24.2) v1(24.72,4.12) v1(25.94,54.19) v1(25.91,52.98) v1(25.89,52.13) v1(25.89,51.15) v1(25.97,55.11) v1(26.16,4.5) v1(26.94,52.13) v1(26.94,51.15) v1(27.02,55.11) v1(26.99,54.19) v1(26.96,52.98) v1(26.97,4.5) v1(27.18,40.44) v1(27.18,37.96) v1(27.29,35.68) v1(27.74,1.04) v1(28.13,52.98) v1(28.11,52.13) v1(28.11,51.15) v1(28.19,55.11) v1(28.16,54.19) v1(28.32,2.34) v1(28.6,1.06) v1(29.24,2.34) v1(29.5,49.8) v1(29.84,40.44) v1(29.84,37.96) v1(29.8,30.74) v1(29.82,30.09) v1(29.83,29.36) v1(30.59,30.75) v1(30.57,30.06) v1(30.59,29.39) v1(30.74,35.77) v1(31.17,49.77) v1(32.13,22.25) v1(32.13,18.76) v1(32.92,49.77) v1(33.15,57.54) v1(33.15,56.11) v1(33.15,54.16) v1(33.15,52.08) v1(33.72,32.48) v1(35.26,35.71) v1(35.42,25.26) v1(36.44,15.31) v1(37.27,32.6) v1(37.58,18.01) v1(37.71,21.87) v1(37.79,49.83) v1(39.31,15.22) v1(39.44,35.74) v1(39.64,49.86) v1(39.91,25.1) v1(40.78,22) v1(41.22,18.17) v1(41.51,32.64) v1(41.82,52.89) v1(42.4,49.86) v1(43.67,35.65) v1(43.91,58.21) v1(43.88,56.83) v1(43.91,55.39) v1(43.88,53.75) v1(44.27,25.14) v1(44.43,21.87) v1(44.52,18.45) v1(45.1,49.86) v1(45.81,32.67) v1(47.34,35.68) v1(48.3,52.89) v1(48.25,25.2) v1(48.91,21.93) v1(48.99,50.02) v1(50.07,32.67) v1(50.33,56.97) v1(50.3,55.51) v1(50.28,53.8) v1(50.41,58.36) v1(51.72,49.96) v1(51.96,35.49) v1(53.34,2.09) v1(53.96,2.09) v1(54.9,52.89) v1(55.64,50.08) v1(55.91,55.53) v1(55.91,53.82) v1(55.95,58.44) v1(55.95,57.04) v1(58.69,50.02) v1(60.01,58.31) v1(60.03,57.25) v1(62.35,49.11) v1(62.34,47.8) v1(62.51,50.43) v1(62.99,45.27) v1(62.96,44.52) v1(62.96,43.82) v1(63.2,31.8) v1(63.25,31.04) v1(63.25,30.33) v1(63.65,44.52) v1(63.65,43.82) v1(63.68,45.27) v1(63.94,58.92) v1(63.88,57.41) v1(63.88,30.16) v1(64.15,10.47) v1(64.15,9.71) v1(64.15,8.18) v1(64.25,8.93) v1(64.28,7.42) v1(64.26,6.66) v1(64.42,45.27) v1(64.39,44.52) v1(64.39,43.82) v1(64.59,30.16) v1(64.85,10.47) v1(64.85,9.71) v1(64.85,8.18) v1(64.95,8.93) v1(64.98,7.42) v1(64.96,6.66) v1(65.1,57.46) v1(65.51,10.47) v1(65.51,9.71) v1(65.51,8.18) v1(65.61,8.93) v1(65.64,7.42) v1(65.62,6.66) v1(66.24,10.47) v1(66.24,9.71) v1(66.24,8.18) v1(66.34,8.93) v1(66.37,7.42) v1(66.35,6.66) v1(66.79,44.04) v1(66.99,10.47) v1(66.99,9.71) v1(66.99,8.18) v1(67.09,8.93) v1(67.12,7.42) v1(67.1,6.66) v1(67.35,56.28) v1(67.38,55.49) v1(67.53,36.49) v1(67.78,10.47) v1(67.78,9.71) v1(67.78,8.18) v1(67.88,8.93) v1(67.91,7.42) v1(67.89,6.66) v1(68.44,10.47) v1(68.44,9.71) v1(68.44,8.18) v1(68.51,35.7) v1(68.54,8.93) v1(68.55,6.66) v1(68.61,36.5) v1(68.56,7.42) v1(68.7,49.16) v1(68.75,47.72) v1(68.86,50.38) v1(69.29,45.28) v1(69.29,44.51) v1(69.29,43.82) v1(69.64,58.63) v1(69.6,36.53) v1(69.58,35.71) v1(69.57,35.03) v1(69.98,45.28) v1(69.98,44.51) v1(69.98,43.82) v1(70.39,58.63) v1(70.72,45.28) v1(70.72,44.51) v1(70.72,43.82) v1(70.66,36.57) v1(70.66,35.69) v1(70.74,35) v1(71.55,35.74) v1(71.56,35) v1(72.9,56.45) v1(72.94,55.41) v1(73.66,15.98) v1(73.66,15.35) v1(73.91,9.96) v1(73.88,9.24) v1(74.04,38.28) v1(74.42,37.74) v1(74.72,32.7) v1(74.72,27.9) v1(75.2,56.66) v1(75.22,55.16) v1(75.26,53.73) v1(75.31,52.37) v1(75.52,29.5) v1(76.32,31.1) v1(76.6,54.44) v1(76.59,53.63) v1(76.64,52.66) v1(76.62,51.84) v1(76.63,50.98) v1(76.61,50.18) v1(76.62,49.38) v1(76.65,47.41) v1(76.65,48.18) v1(76.79,45.95) v1(76.93,44.31) v1(76.96,43.63) v1(77.04,43) v1(77.12,42.34) v1(77.12,29.5) v1(77.24,41.7) v1(77.44,56.8) v1(77.44,56.08) v1(77.44,55.37) v1(77.36,41.05) v1(77.45,2.07) v1(77.45,1.35) v1(77.45,0.64) v1(77.46,59.23) v1(77.46,58.51) v1(77.46,57.76) v1(77.46,53.27) v1(77.46,52.27) v1(77.49,40.4) v1(77.47,4.5) v1(77.47,3.78) v1(77.47,3.03) v1(77.63,39.74) v1(77.63,36.11) v1(77.71,39.01) v1(77.73,36.86) v1(77.77,38.28) v1(77.77,37.6) v1(77.92,27.1) v1(78.06,45.96) v1(78.09,44.28) v1(78.06,43.58) v1(78.18,48.24) v1(78.19,47.48) v1(78.18,42.82) v1(78.25,42.05) v1(78.31,41.41) v1(78.49,40.6) v1(78.52,36.11) v1(78.65,36.85) v1(78.74,53.27) v1(78.73,52.28) v1(78.73,50.06) v1(78.73,49.35) v1(78.74,37.58) v1(78.72,31.1) v1(78.72,29.5) v1(78.72,27.1) v1(78.82,59.37) v1(78.85,58.57) v1(78.85,57.86) v1(78.84,56.37) v1(78.78,39.92) v1(78.79,39.16) v1(78.77,38.43) v1(78.86,57.1) v1(78.86,55.63) v1(78.87,54.86) v1(78.94,5.33) v1(78.9,4.46) v1(78.91,3.7) v1(78.91,2.98) v1(78.91,2.25) v1(78.9,1.57) v1(78.88,0.77) v1(79.03,11.55) v1(79.04,10.81) v1(79.04,10.05) v1(79.03,9.37) v1(79.03,8.68) v1(79.04,8.03) v1(79.02,7.28) v1(79.15,12.26) v1(79.21,40.59) v1(79.28,48.29) v1(79.32,47.5) v1(79.35,45.98) v1(79.3,41.37) v1(79.31,14.81) v1(79.32,14.2) v1(79.33,13.57) v1(79.4,54.15) v1(79.39,42.1) v1(79.37,12.87) v1(79.49,44.32) v1(79.48,43.63) v1(79.45,42.87) v1(79.52,31.1) v1(79.52,25.5) v1(79.47,6.76) v1(79.48,5.91) v1(79.58,16.43) v1(79.78,37.65) v1(79.89,38.33) v1(80.03,39.07) v1(80.05,20.17) v1(80.16,39.75) v1(80.31,40.55) v1(80.32,31.1) v1(80.29,19.59) v1(80.43,41.26) v1(80.55,41.98) v1(80.53,17.13) v1(80.51,6.77) v1(80.61,44.19) v1(80.59,43.5) v1(80.61,42.69) v1(80.61,38.16) v1(80.55,18.96) v1(80.56,16.34) v1(80.55,5.9) v1(80.81,49.4) v1(80.83,48.31) v1(80.85,47.41) v1(80.76,46.03) v1(80.82,20.86) v1(80.77,15.04) v1(80.77,14.29) v1(80.77,13.51) v1(80.77,12.75) v1(80.86,54.49) v1(80.87,53.69) v1(80.88,52.68) v1(80.87,51.69) v1(80.86,50.95) v1(80.85,50.13) v1(80.95,38.88) v1(81.13,59.5) v1(81.12,34.3) v1(81.12,27.1) v1(81.12,25.5) v1(81.14,20.27) v1(81.14,5.41) v1(81.17,58.71) v1(81.16,57.98) v1(81.15,57.08) v1(81.17,56.31) v1(81.15,55.44) v1(81.22,4.62) v1(81.22,3.89) v1(81.22,3.17) v1(81.22,2.4) v1(81.22,1.71) v1(81.22,0.81) v1(81.26,17.83) v1(81.28,11.87) v1(81.28,10.9) v1(81.28,8.69) v1(81.28,7.71) v1(81.43,19.67) v1(81.47,21.49) v1(81.6,17.29) v1(81.83,20.93) v1(81.85,12.68) v1(81.92,33.5) v1(81.92,29.5) v1(81.91,16.67) v1(81.89,15.17) v1(81.86,14.38) v1(81.86,13.54) v1(82.06,38.94) v1(82.14,20.4) v1(82.07,18.46) v1(82.33,24.82) v1(82.29,22.15) v1(82.38,17.94) v1(82.54,56.8) v1(82.54,56.08) v1(82.54,55.37) v1(82.54,2.2) v1(82.54,1.49) v1(82.54,0.77) v1(82.56,59.23) v1(82.56,58.51) v1(82.56,57.76) v1(82.59,24.15) v1(82.55,8.69) v1(82.55,7.7) v1(82.56,4.64) v1(82.56,3.92) v1(82.56,3.16) v1(82.68,17.37) v1(82.94,23.62) v1(82.91,19.52) v1(82.91,16.69) v1(83.24,44.09) v1(83.22,41.43) v1(83.19,37.64) v1(83.24,14.87) v1(83.29,19.05) v1(83.3,14.14) v1(83.33,13.38) v1(83.37,12.7) v1(83.53,44.68) v1(83.52,31.1) v1(83.52,30.3) v1(83.52,29.5) v1(83.52,28.7) v1(83.56,42.21) v1(83.57,38.23) v1(83.61,11.75) v1(83.64,10.92) v1(83.64,10.06) v1(83.63,9.35) v1(83.64,8.57) v1(83.63,7.85) v1(83.63,7.05) v1(83.74,36.62) v1(83.72,18.56) v1(83.9,45.36) v1(83.86,42.86) v1(83.94,38.78) v1(83.94,21.58) v1(84.02,37.21) v1(84.01,20.41) v1(84.13,25.23) v1(84.1,18.04) v1(84.21,45.94) v1(84.17,43.51) v1(84.31,19.55) v1(84.43,37.76) v1(84.5,46.59) v1(84.53,44.2) v1(84.48,39.25) v1(84.47,24.7) v1(84.46,17.5) v1(84.61,36.28) v1(84.61,33.5) v1(84.69,35.42) v1(84.73,25.39) v1(84.67,16.84) v1(84.84,47.17) v1(84.84,44.81) v1(84.83,36.99) v1(84.76,19.02) v1(84.78,16.16) v1(84.9,38.22) v1(84.9,26.03) v1(84.92,15.49) v1(84.97,34.57) v1(84.98,22.8) v1(85.03,14.85) v1(85.1,39.65) v1(85.14,18.48) v1(85.11,14.16) v1(85.19,47.69) v1(85.22,45.48) v1(85.22,23.84) v1(85.34,38.64) v1(85.29,33.46) v1(85.25,13.49) v1(85.37,37.48) v1(85.36,26.46) v1(85.39,12.85) v1(85.48,17.89) v1(85.56,48.44) v1(85.56,46.13) v1(85.57,24.36) v1(85.59,12.14) v1(85.67,35.86) v1(85.72,24.94) v1(85.69,22.59) v1(85.73,17.21) v1(85.8,39.88) v1(85.78,33.88) v1(85.79,11.47) v1(85.87,48.98) v1(85.85,46.78) v1(85.92,35.24) v1(85.92,16.5) v1(85.96,38.53) v1(86,37.55) v1(86.03,34.61) v1(85.99,26.63) v1(86.02,15.81) v1(86.03,10.85) v1(86.19,49.55) v1(86.19,47.5) v1(86.23,24.22) v1(86.15,15.08) v1(86.3,35.92) v1(86.34,14.36) v1(86.33,10.19) v1(86.41,39.9) v1(86.39,25.09) v1(86.39,22.56) v1(86.48,48.1) v1(86.52,28.12) v1(86.51,13.71) v1(86.62,50.02) v1(86.62,38.52) v1(86.61,37.54) v1(86.61,29.48) v1(86.6,26.64) v1(86.69,13.03) v1(86.75,48.68) v1(86.82,9.72) v1(86.91,35.93) v1(86.92,24.22) v1(86.91,12.39) v1(87.03,39.9) v1(87.14,25.11) v1(87.09,22.57) v1(87.12,11.74) v1(87.18,50.3) v1(87.17,49.21) v1(87.23,38.53) v1(87.24,37.54) v1(87.21,26.64) v1(87.3,11.11) v1(87.43,9.35) v1(87.52,35.94) v1(87.7,39.91) v1(87.65,24.18) v1(87.74,10.62) v1(87.81,50.44) v1(87.82,49.45) v1(87.82,26.64) v1(87.82,25.11) v1(87.78,22.56) v1(87.85,38.55) v1(87.86,37.53) v1(88.04,9.24) v1(88.19,35.82) v1(88.44,50.61) v1(88.45,39.94) v1(88.42,26.67) v1(88.46,49.28) v1(88.54,22.44) v1(88.51,10.7) v1(88.65,37.9) v1(88.75,24.64) v1(88.76,9.24) v1(88.89,35.72) v1(89.04,50.66) v1(89.07,49.25) v1(89.11,40.2) v1(89.07,26.73) v1(89.14,22.4) v1(89.17,10.72) v1(89.39,9.2) v1(89.65,50.65) v1(89.6,37.9) v1(89.56,35.71) v1(89.63,24.64) v1(89.69,49.24) v1(89.73,40.21) v1(89.72,26.75) v1(89.82,10.72) v1(89.86,22.41) v1(90.1,9.22) v1(90.24,35.71) v1(90.31,50.67) v1(90.31,49.24) v1(90.35,40.22) v1(90.37,26.75) v1(90.44,10.73) v1(90.6,22.42) v1(90.72,9.2) v1(90.92,49.25) v1(91,50.67) v1(90.96,35.7) v1(91.05,40.22) v1(91.05,26.76) v1(91.07,10.73) v1(91.24,22.42) v1(91.43,9.21) v1(91.62,35.7) v1(91.73,50.69) v1(91.65,49.22) v1(91.67,26.75) v1(91.77,40.25) v1(91.78,10.73) v1(91.93,39.21) v1(91.87,37.9) v1(91.95,25.84) v1(91.93,24.64) v1(91.89,22.4) v1(92.13,9.21) v1(92.32,49.22) v1(92.3,35.69) v1(92.39,50.7) v1(92.43,40.27) v1(92.42,26.75) v1(92.47,10.76) v1(92.56,22.38) v1(92.77,37.9) v1(92.82,25.84) v1(92.81,24.64) v1(92.86,39.21) v1(92.87,9.23) v1(93.02,50.71) v1(92.98,49.22) v1(93.01,35.69) v1(93.12,40.25) v1(93.24,22.38) v1(93.22,10.74) v1(93.27,26.77) v1(93.63,37.29) v1(93.63,36.08) v1(93.64,23.95) v1(93.64,22.86) v1(93.63,9.12) v1(93.74,50.86) v1(93.65,49.2) v1(93.85,10.76) v1(93.99,26.79) v1(94.41,37.31) v1(94.44,36.09) v1(94.41,23.95) v1(94.41,22.86) v1(94.53,48.98) v1(94.52,10.94) v1(94.48,9.18) v1(94.69,51.04) v1(95.03,24.53) v1(95.09,37.84) v1(95.07,35.44) v1(95.08,22.21) v1(95.21,11.15) v1(95.19,8.94) v1(95.26,48.85) v1(95.35,52.56) v1(95.43,51.07) v1(95.35,47.46) v1(95.35,39.23) v1(95.35,34.13) v1(95.35,25.89) v1(95.35,20.79) v1(95.35,12.56) v1(95.35,7.46) v1(95.75,24.51) v1(95.77,37.83) v1(95.78,35.44) v1(95.83,22.23) v1(95.94,11.16) v1(96.03,48.86) v1(96.07,52.56) v1(96.07,47.46) v1(96.07,39.23) v1(96.07,34.13) v1(96.07,25.89) v1(96.07,20.79) v1(96.07,12.56) v1(96.08,8.94) v1(96.07,7.46) v1(96.19,51.06) v1(96.51,37.82) v1(96.49,35.45) v1(96.5,24.51) v1(96.57,22.23) v1(96.65,11.17) v1(96.68,48.86) v1(96.83,52.56) v1(96.83,47.46) v1(96.83,39.23) v1(96.83,34.13) v1(96.83,25.89) v1(96.83,20.79) v1(96.83,12.56) v1(96.83,7.46) v1(96.94,51.06) v1(96.88,8.91) v1(97.22,37.84) v1(97.19,35.45) v1(97.28,24.51) v1(97.27,22.21) v1(97.33,11.16) v1(97.35,48.88) v1(97.61,51.07) v1(97.65,8.91) v1(97.78,52.54) v1(97.78,47.44) v1(97.78,39.21) v1(97.78,34.11) v1(97.78,25.87) v1(97.78,20.77) v1(97.78,12.54) v1(97.78,7.44) v1(98.01,37.83) v1(97.97,35.46) v1(98.03,24.53) v1(97.99,22.23) v1(98.1,48.89) v1(98.05,11.17) v1(98.5,52.54) v1(98.48,51.09) v1(98.5,47.44) v1(98.5,39.21) v1(98.5,34.11) v1(98.5,25.87) v1(98.5,20.77) v1(98.5,12.54) v1(98.49,8.91) v1(98.5,7.44) v1(98.72,37.87) v1(98.69,35.47) v1(98.75,22.23) v1(98.74,11.19) v1(98.81,48.89) v1(98.78,24.53) v1(99.21,52.54) v1(99.24,51.1) v1(99.21,47.44) v1(99.21,39.21) v1(99.21,34.11) v1(99.21,25.87) v1(99.21,20.77) v1(99.21,12.54) v1(99.23,8.94) v1(99.21,7.44) v1(99.4,37.88) v1(99.4,35.44) v1(99.42,22.21) v1(99.39,11.22) v1(99.48,48.9) v1(99.46,24.54)
